# Altium project 6_Layer_Signal_Board.PrjPcb (part 1 of 2)
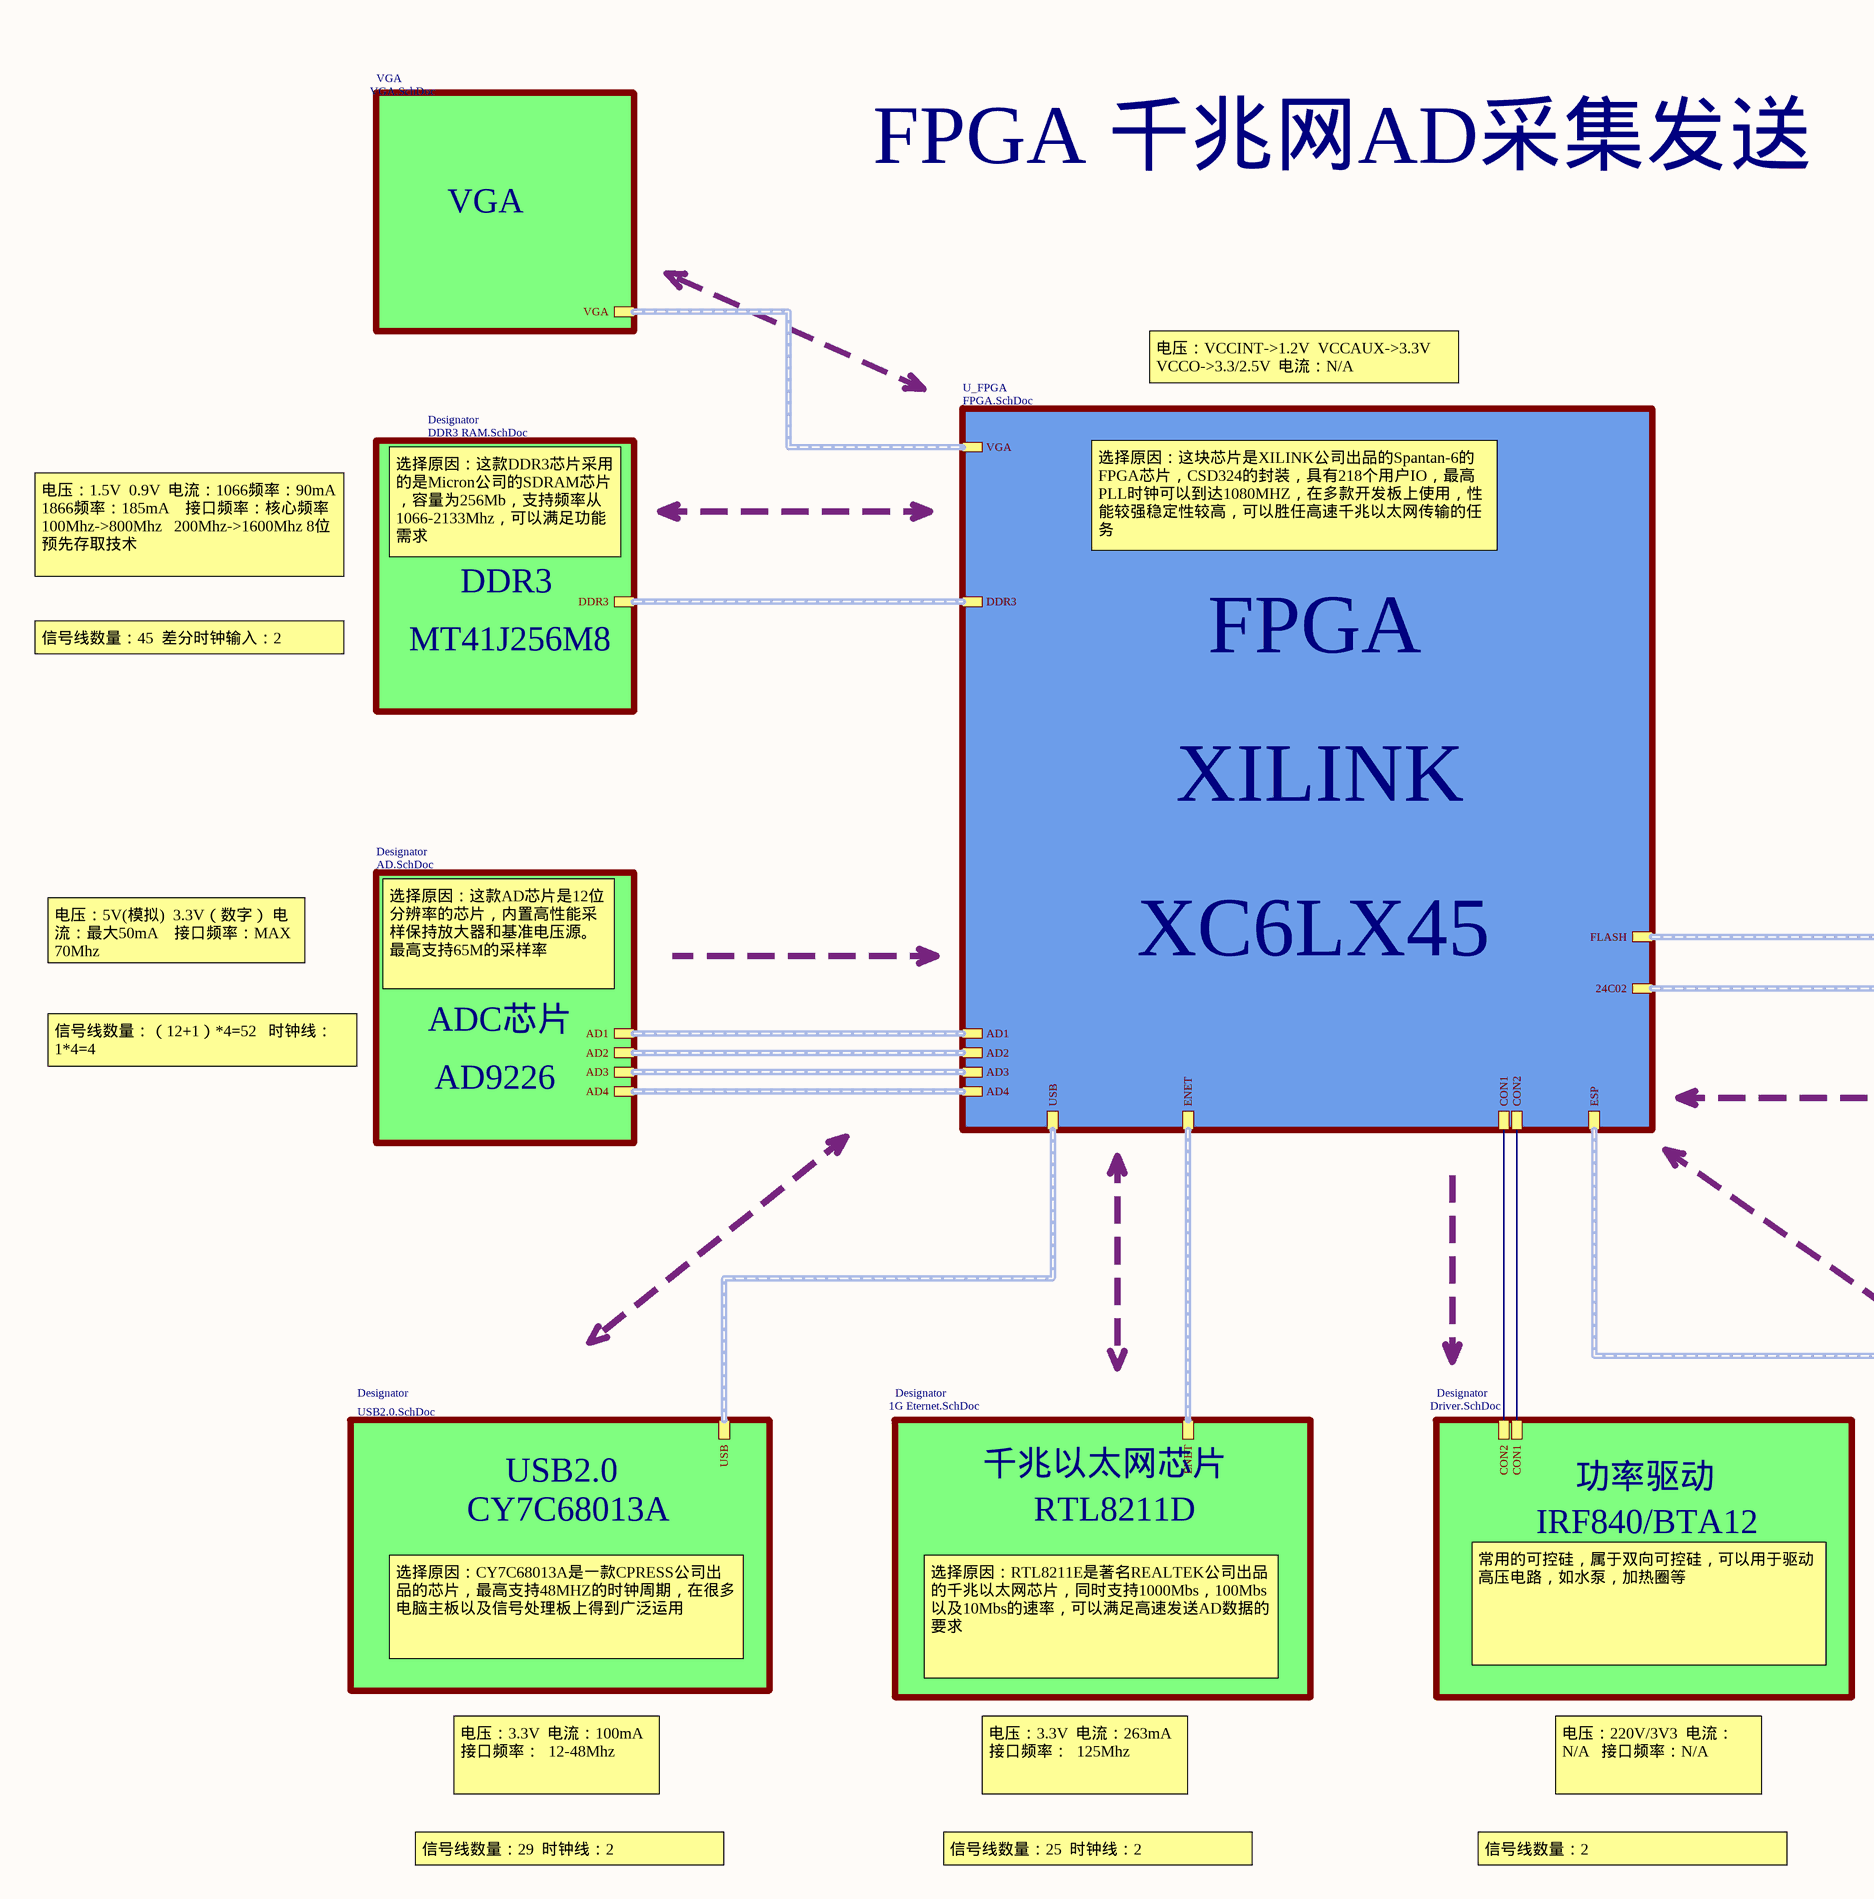
[diagram p0: TOPLEVEL.SchDoc, left]
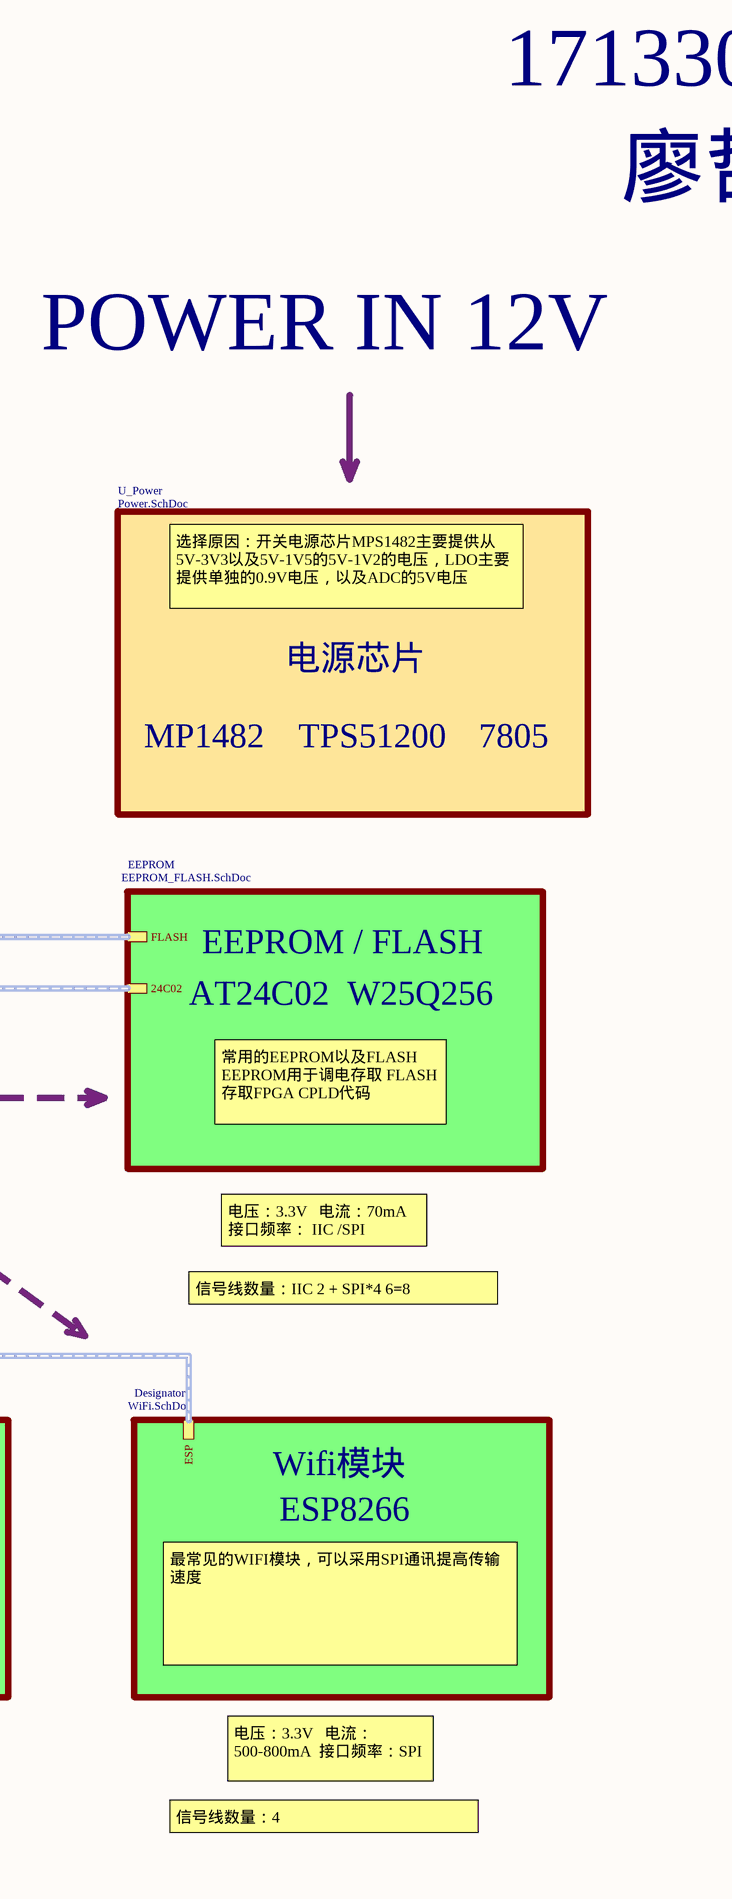
[diagram p1: TOPLEVEL.SchDoc, right]
11 sheets, 419 parts. Net scope: hierarchical (ports join the sheet entries above them; power ports are global).
Board file: 6_Layer_Singal_Board.PcbDoc
Sheets:
  TOPLEVEL.SchDoc
    U_FPGA = FPGA.SchDoc
    U_Power = Power.SchDoc
    Designator = 1G Eternet.SchDoc
    Designator = USB2.0.SchDoc
    Designator = DDR3 RAM.SchDoc
    Designator = AD.SchDoc
    Designator = Driver.SchDoc
    Designator = WiFi.SchDoc
    EEPROM = EEPROM_FLASH.SchDoc
    VGA = VGA.SchDoc

## Sheet TOPLEVEL.SchDoc
size A2; Organization: Altium Limited; Address1: L3, 12a Rodborough Rd; Address2: Frenchs Forest; Address3: NSW; Address4: Australia 2086

### Sub-sheets
Designator = 1G Eternet.SchDoc: ENET (harness ENET)
Designator = USB2.0.SchDoc: USB (harness USB)
Designator = DDR3 RAM.SchDoc: DDR3 (harness DDR3)
Designator = AD.SchDoc: AD2 (harness AD2), AD1 (harness AD1), AD4 (harness AD4), AD3 (harness AD3)
Designator = Driver.SchDoc: CON2, CON1
Designator = WiFi.SchDoc: ESP (harness ESP)
EEPROM = EEPROM_FLASH.SchDoc: 24C02 (harness 24C02), FLASH (harness FLASH)
U_FPGA = FPGA.SchDoc: DDR3 (harness DDR3), USB (harness USB), CON1, CON2, AD3 (harness AD3), AD2 (harness AD2), AD4 (harness AD4), AD1 (harness AD1), ENET (harness ENET), ESP (harness ESP), 24C02 (harness 24C02), FLASH (harness FLASH), VGA (harness VGA)
U_Power = Power.SchDoc: no entries
VGA = VGA.SchDoc: VGA (harness VGA)

### Nets
NetIC500_2: sheet U_FPGA/CON2, sheet Designator/CON1
NetIC501_2: sheet U_FPGA/CON1, sheet Designator/CON2

### Buses and harness runs
harness sheet Designator/AD1 = sheet U_FPGA/AD1
harness sheet Designator/AD2 = sheet U_FPGA/AD2
harness sheet Designator/AD3 = sheet U_FPGA/AD3
harness sheet Designator/AD4 = sheet U_FPGA/AD4
harness sheet Designator/DDR3 = sheet U_FPGA/DDR3
harness sheet Designator/ENET = sheet U_FPGA/ENET
harness sheet Designator/ESP = sheet U_FPGA/ESP
harness sheet Designator/USB = sheet U_FPGA/USB
harness sheet EEPROM/24C02 = sheet U_FPGA/24C02
harness sheet EEPROM/FLASH = sheet U_FPGA/FLASH
harness sheet U_FPGA/VGA = sheet VGA/VGA

### Notes on the sheet
- 1713304422
- FPGA 千兆网AD采集发送
- VGA
- 廖哲霖
- 电压：VCCINT->1.2V  VCCAUX->3.3V VCCO->3.3/2.5V  电流：N/A
- POWER IN 12V
- 电压：1.5V  0.9V  电流：1066频率：90mA  1866频率：185mA    接口频率：核心频率100Mhz->800Mhz   200Mhz->1600Mhz 8位预先存取技术
- 选择原因：这款DDR3芯片采用的是Micron公司的SDRAM芯片，容量为256Mb，支持频率从1066-2133Mhz，可以满足功能需求
- 选择原因：这块芯片是XILINK公司出品的Spantan-6的FPGA芯片，CSD324的封装，具有218个用户IO，最高PLL时钟可以到达1080MHZ，在多款开发板上使用，性能较强稳定性较高，可以胜任高速千兆以太网传输的任务
- DDR3
- 选择原因：开关电源芯片MPS1482主要提供从5V-3V3以及5V-1V5的5V-1V2的电压，LDO主要提供单独的0.9V电压，以及ADC的5V电压
- 信号线数量：45  差分时钟输入：2
- MT41J256M8
- FPGA
- 电源芯片
- MP1482
- TPS51200
- 7805
- XILINK
- 电压：5V(模拟)  3.3V（数字） 电流：最大50mA    接口频率：MAX 70Mhz
- EEPROM / FLASH
- 选择原因：这款AD芯片是12位分辨率的芯片，内置高性能采样保持放大器和基准电压源。最高支持65M的采样率
- XC6LX45
- AT24C02  W25Q256
- 信号线数量：（12+1）*4=52   时钟线：1*4=4
- ADC芯片
- AD9226
- 常用的EEPROM以及FLASH EEPROM用于调电存取 FLASH存取FPGA CPLD代码
- 电压：3.3V   电流：70mA 接口频率： IIC /SPI
- 信号线数量：IIC 2 + SPI*4 6=8
- 千兆以太网芯片
- Wifi模块
- CY7C68013A
- USB2.0
- RTL8211D
- IRF840/BTA12
- 功率驱动
- ESP8266
- 选择原因：CY7C68013A是一款CPRESS公司出品的芯片，最高支持48MHZ的时钟周期，在很多电脑主板以及信号处理板上得到广泛运用
- 常用的可控硅，属于双向可控硅，可以用于驱动高压电路，如水泵，加热圈等
- 最常见的WIFI模块，可以采用SPI通讯提高传输速度
- 选择原因：RTL8211E是著名REALTEK公司出品的千兆以太网芯片，同时支持1000Mbs，100Mbs以及10Mbs的速率，可以满足高速发送AD数据的要求
- 电压：3.3V  电流：100mA  接口频率：  12-48Mhz
- 电压：3.3V  电流：263mA  接口频率：  125Mhz
- 电压：220V/3V3  电流：N/A   接口频率：N/A
- 电压：3.3V   电流：500-800mA  接口频率：SPI
- 信号线数量：29  时钟线：2
- 信号线数量：25  时钟线：2
- 信号线数量：2
- 信号线数量：4
- Title
- Size:
- Date:
- File:
- A2
- Number:
- Time:
- Revision:
- Sheet
- of

## Sheet FPGA.SchDoc
size A1; Organization: Altium Limited; Address1: L3, 12a Rodborough Rd; Address2: Frenchs Forest; Address3: NSW; Address4: Australia 2086
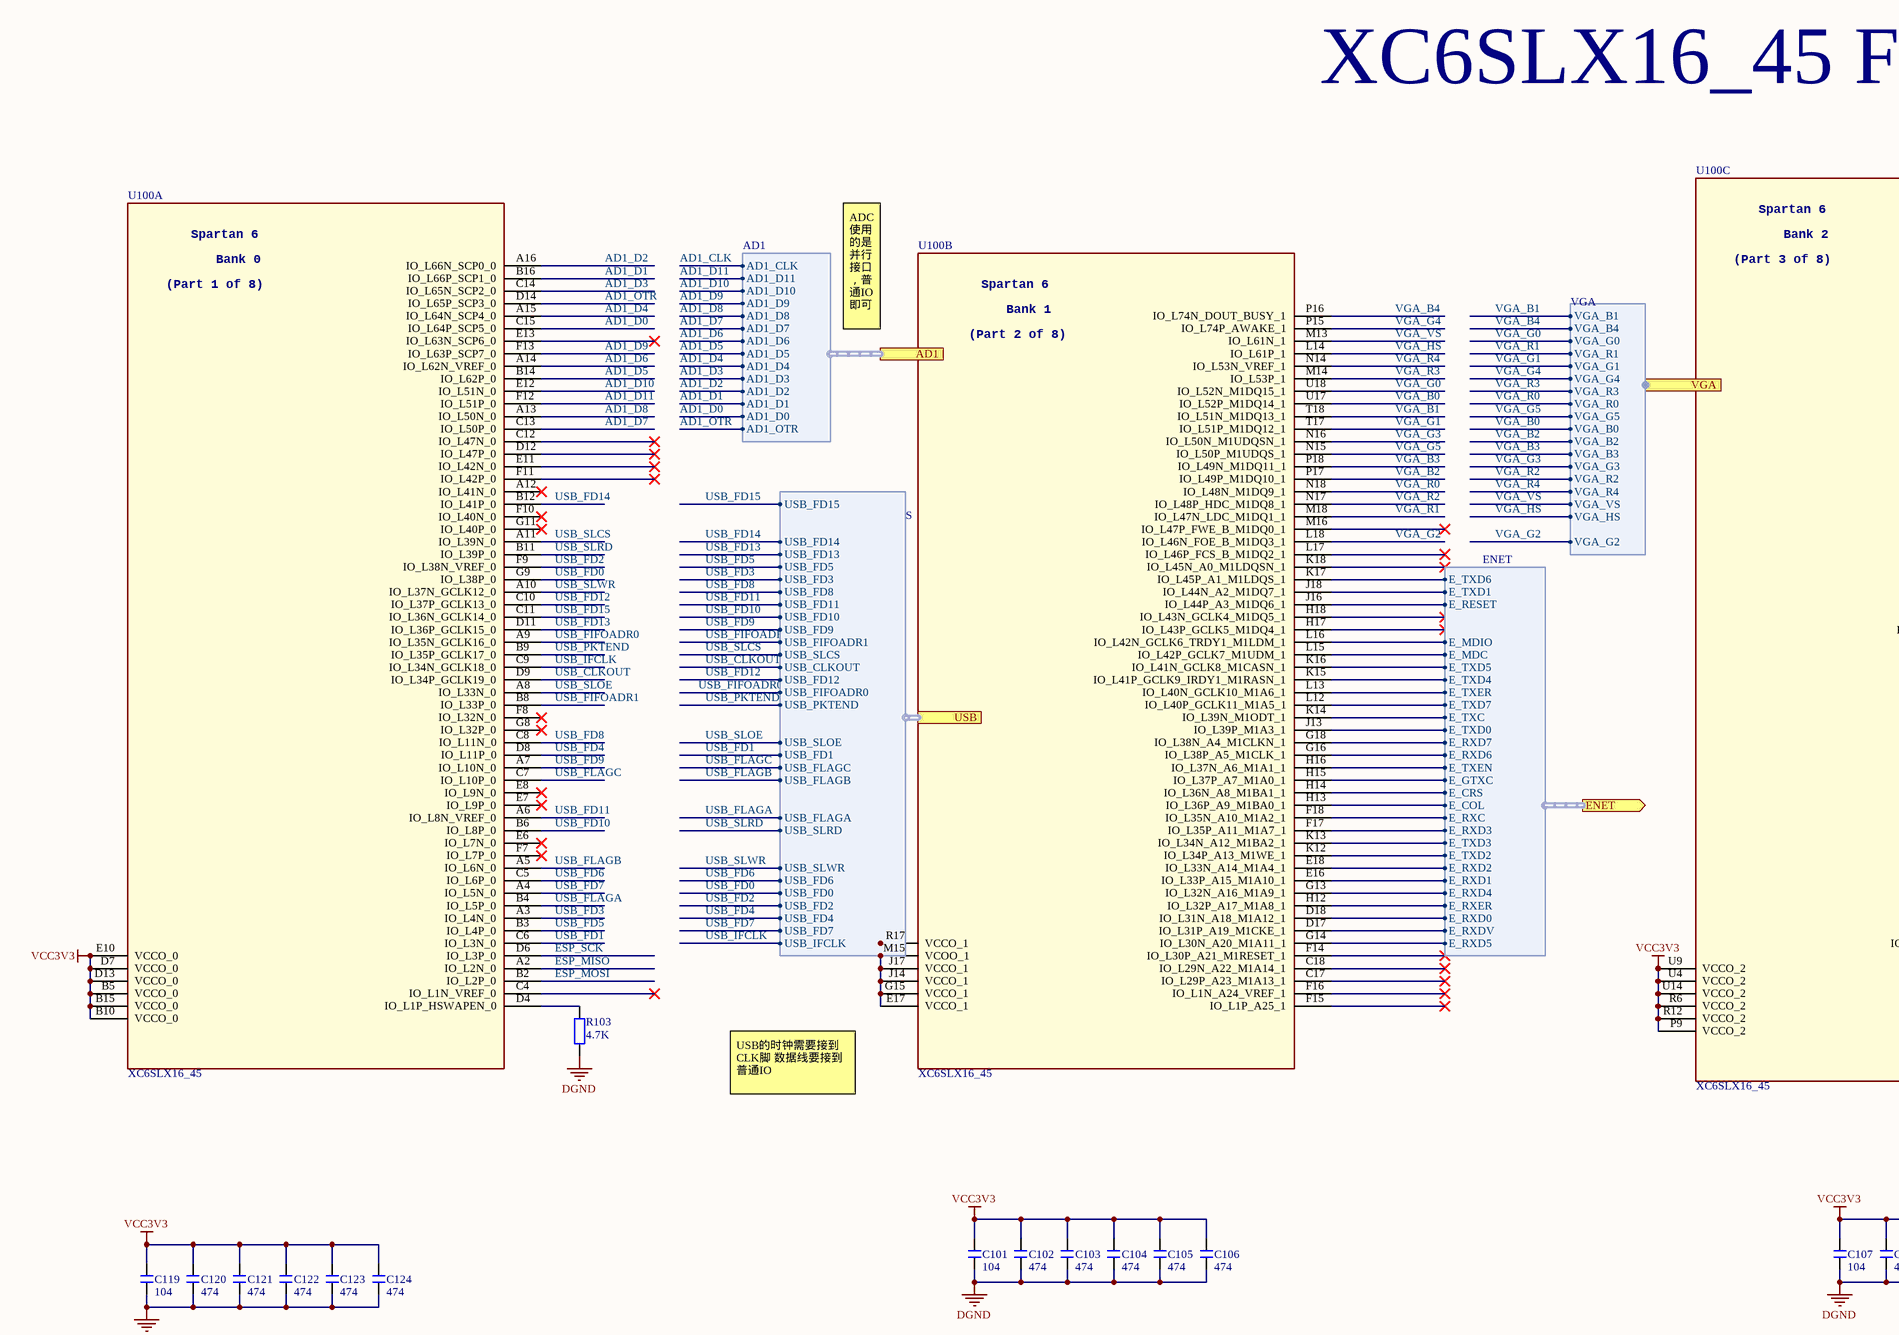
[diagram p2: FPGA.SchDoc, top left]
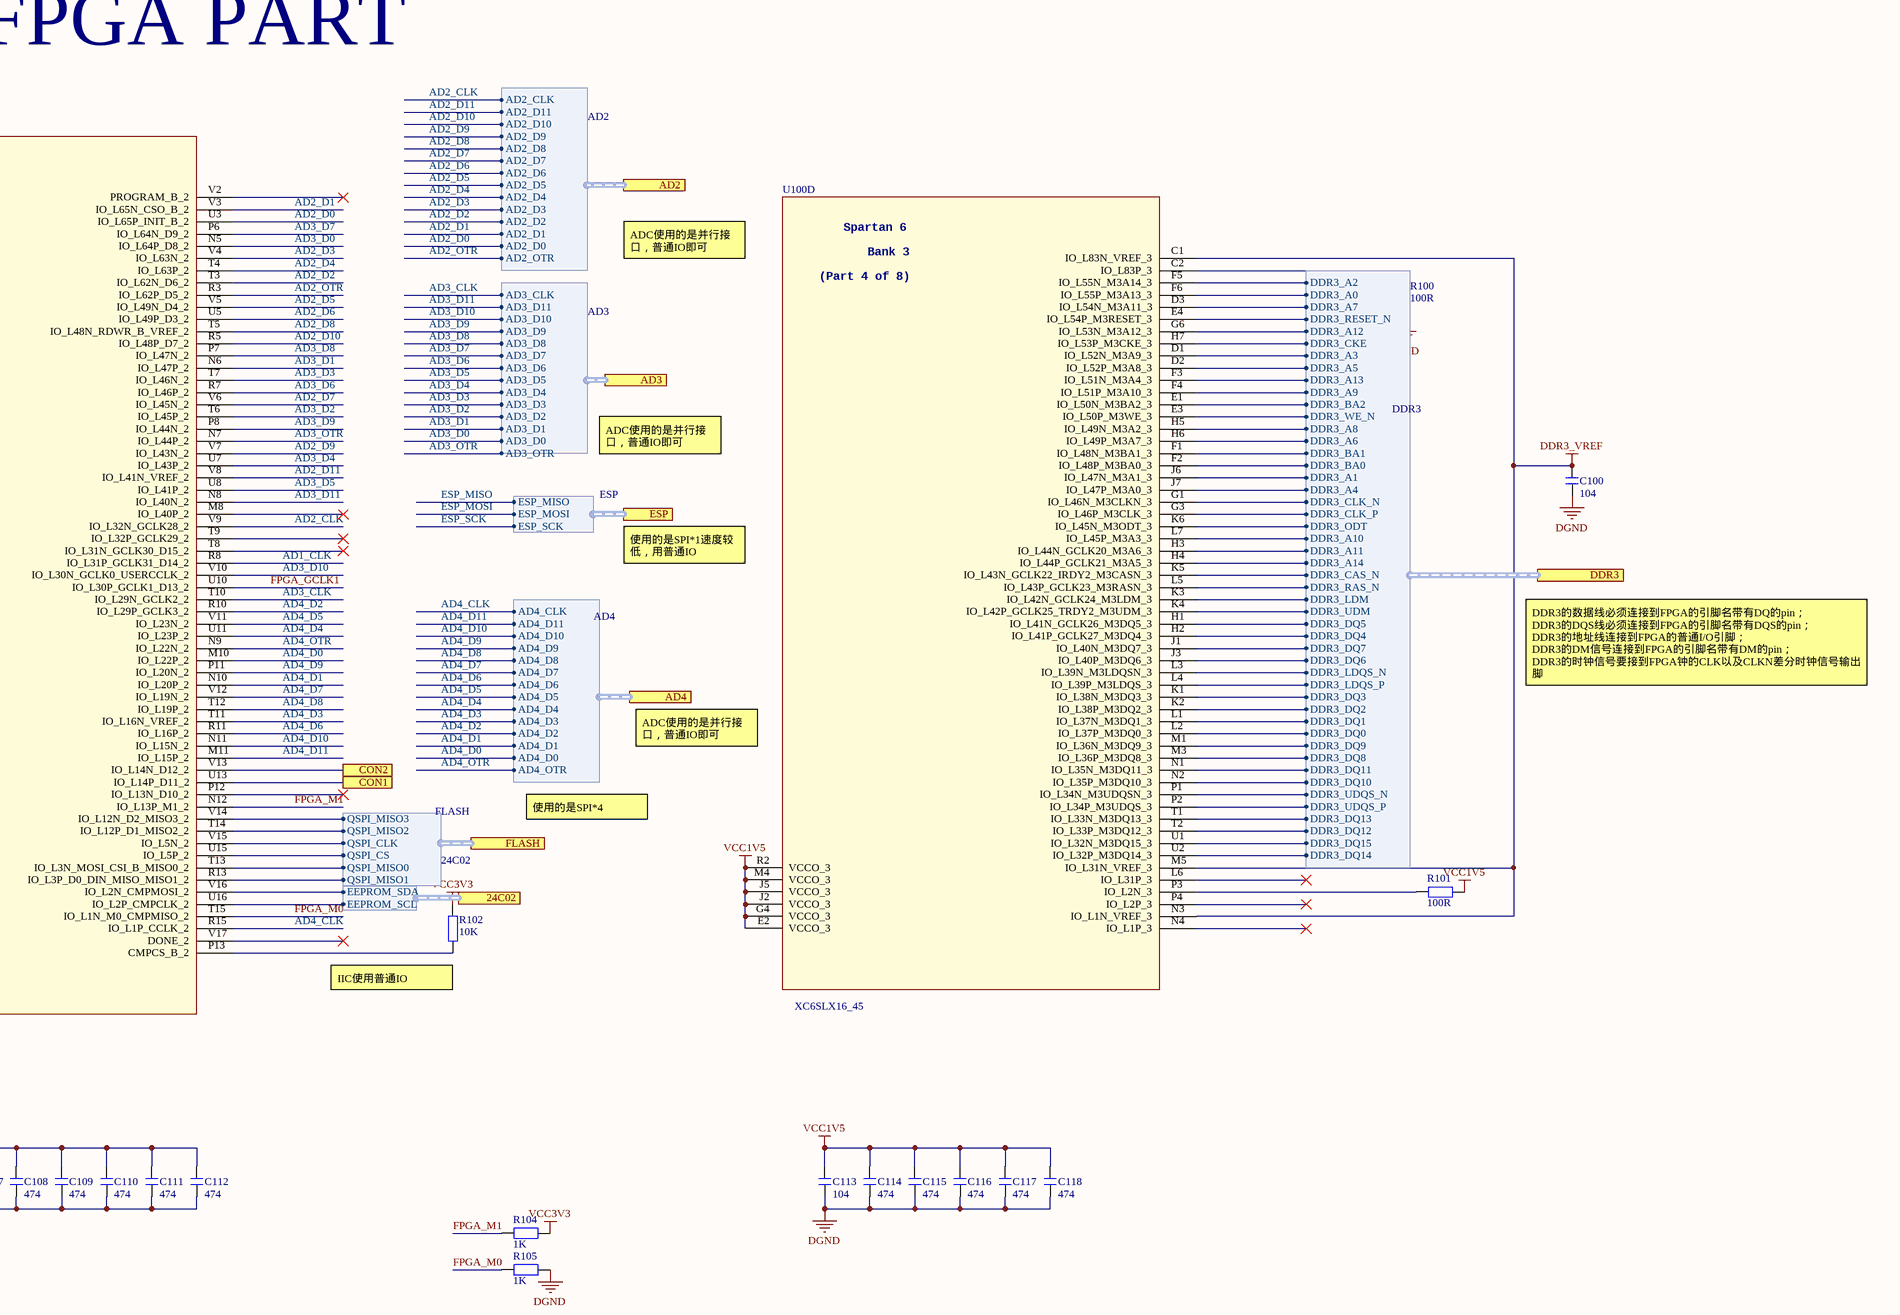
[diagram p3: FPGA.SchDoc, top right]
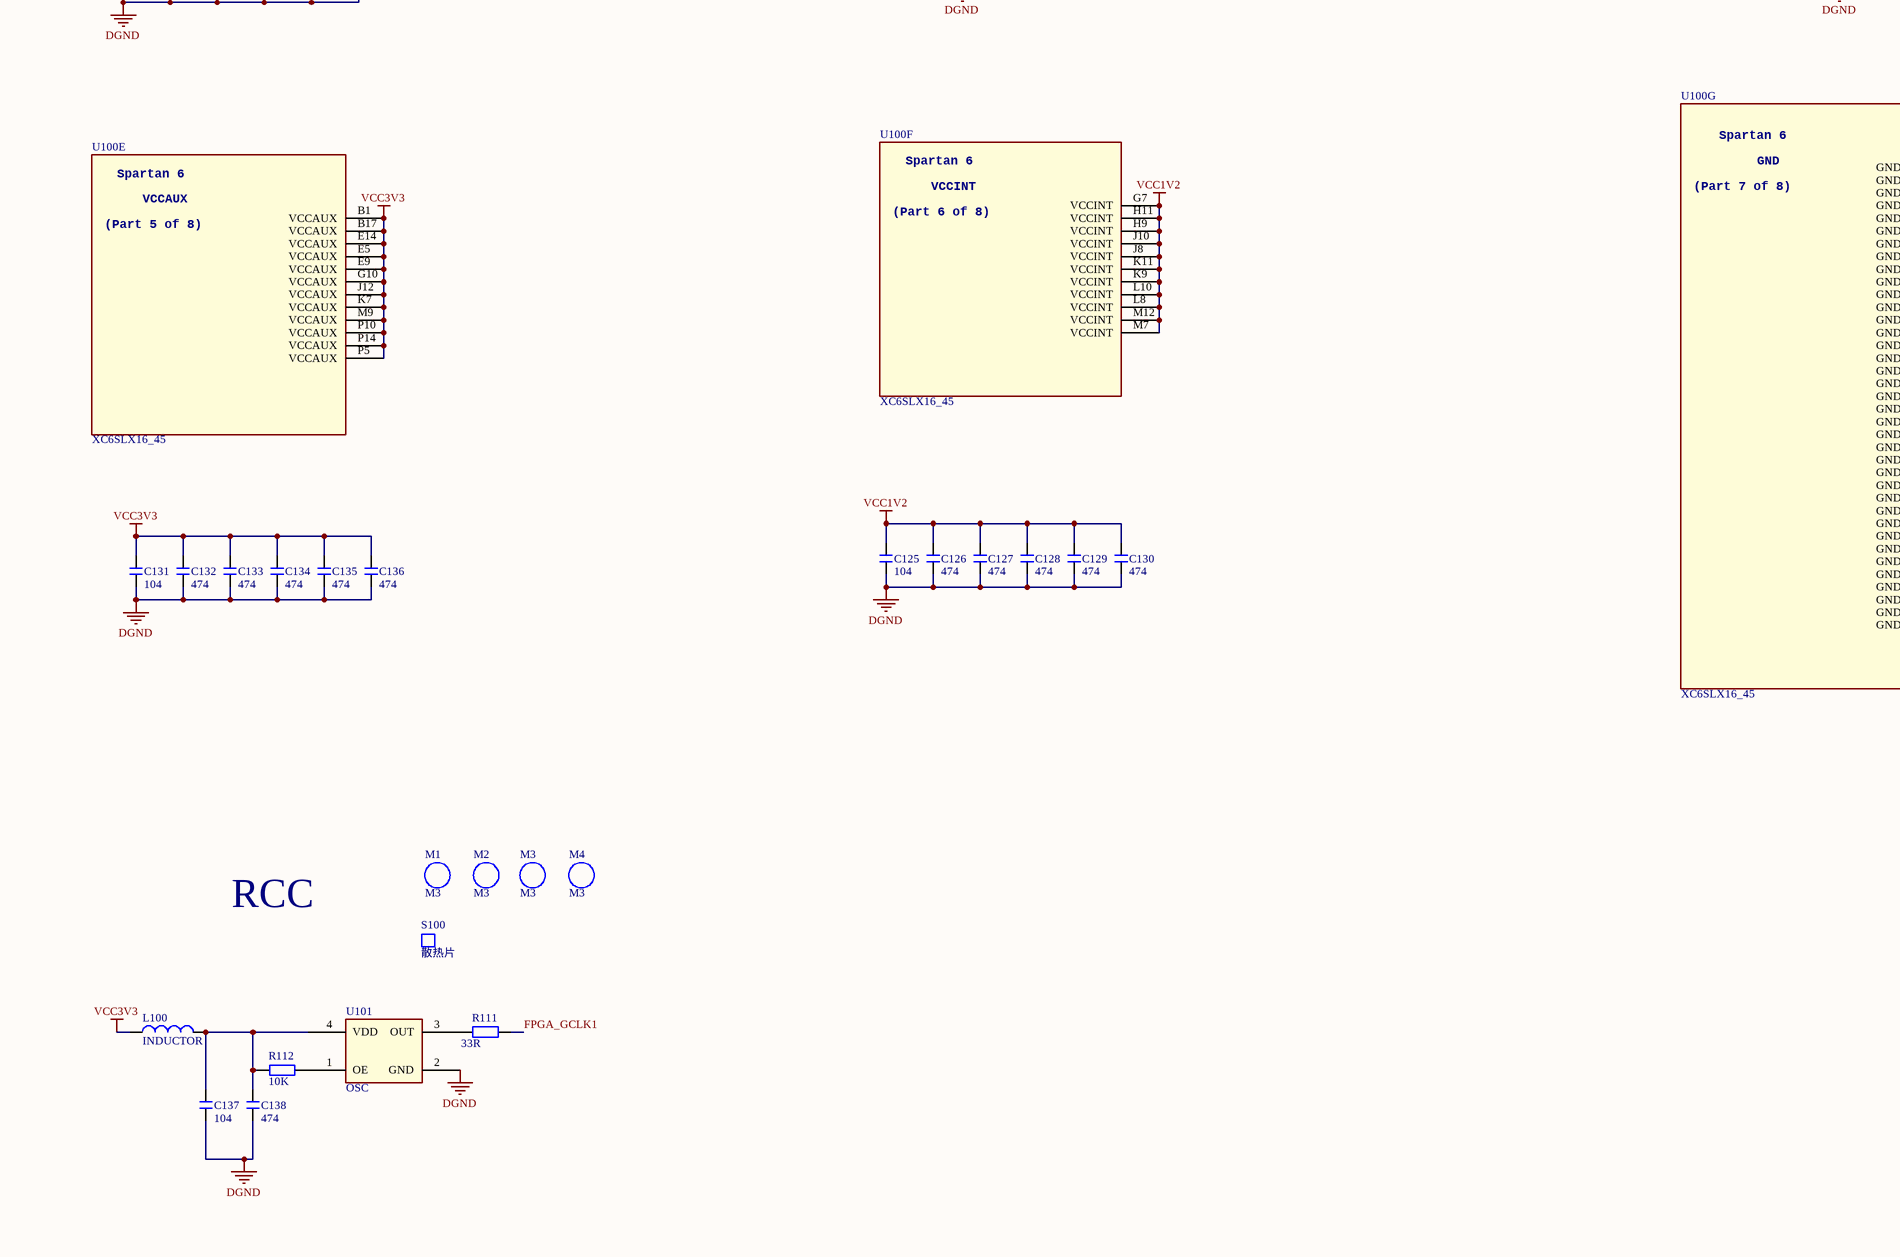
[diagram p4: FPGA.SchDoc, bottom left]
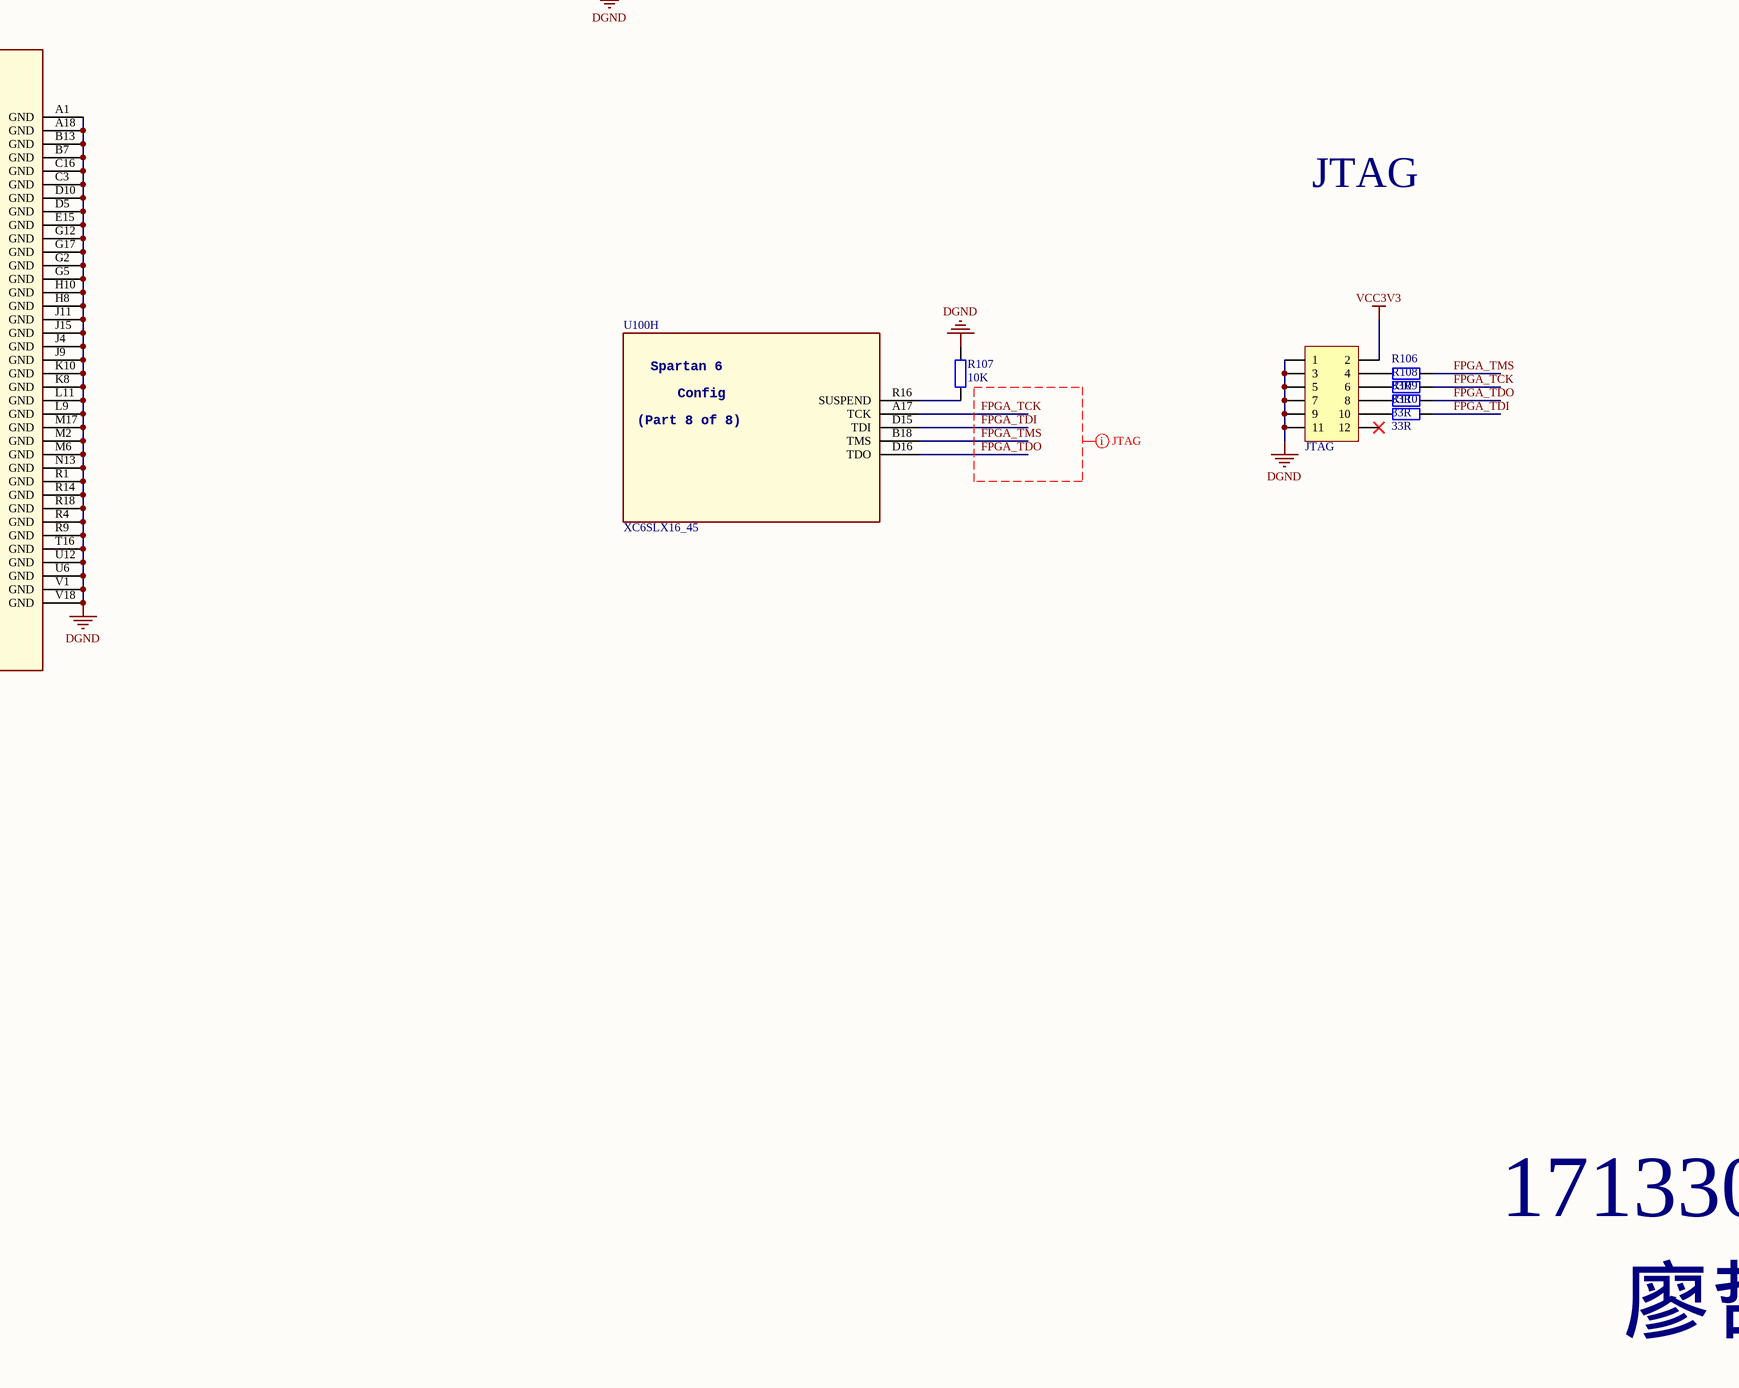
[diagram p5: FPGA.SchDoc, bottom right]

### Parts
C100  104  [C 0402_M]
C101  104  [C 0402_M]
C102  474  [C 0402_M]
C103  474  [C 0402_M]
C104  474  [C 0402_M]
C105  474  [C 0402_M]
C106  474  [C 0402_M]
C107  104  [C 0402_M]
C108  474  [C 0402_M]
C109  474  [C 0402_M]
C110  474  [C 0402_M]
C111  474  [C 0402_M]
C112  474  [C 0402_M]
C113  104  [C 0402_M]
C114  474  [C 0402_M]
C115  474  [C 0402_M]
C116  474  [C 0402_M]
C117  474  [C 0402_M]
C118  474  [C 0402_M]
C119  104  [C 0402_M]
C120  474  [C 0402_M]
C121  474  [C 0402_M]
C122  474  [C 0402_M]
C123  474  [C 0402_M]
C124  474  [C 0402_M]
C125  104  [C 0402_M]
C126  474  [C 0402_M]
C127  474  [C 0402_M]
C128  474  [C 0402_M]
C129  474  [C 0402_M]
C130  474  [C 0402_M]
C131  104  [C 0402_M]
C132  474  [C 0402_M]
C133  474  [C 0402_M]
C134  474  [C 0402_M]
C135  474  [C 0402_M]
C136  474  [C 0402_M]
C137  104  [C 0402_M]
C138  474  [C 0402_M]
JTAG  Header 6X2  [IDC2.54-LI-2x6P]  (value not drawn)
L100  INDUCTOR  [L 0805]
M1  M3  [M3 140X350]
M2  M3  [M3 140X350]
M3  M3  [M3 140X350]
M4  M3  [M3 140X350]
R100  100R  [R 0402_M]
R101  100R  [R 0402_M]
R102  10K  [R 0402_M]
R103  4.7K  [R 0402_M]
R104  1K  [R 0402_M]
R105  1K  [R 0402_M]
R106  33R  [R 0402_M]
R107  10K  [R 0402_M]
R108  33R  [R 0402_M]
R109  33R  [R 0402_M]
R110  33R  [R 0402_M]
R111  33R  [R 0402_M]
R112  10K  [R 0402_M]
S100  散热片  [SRP10-15-21]
U100  XC6SLX16_45  [BGA324C80P18X18_1500X1500X150]  (parts A,B,C,D,E,F,G,H of 8)
U101  OSC  [OSC 8045-4P]

### Ports
24C02 (harness 24C02), AD1 (harness AD1), AD2 (harness AD2), AD3 (harness AD3), AD4 (harness AD4), CON1, CON2, DDR3 (harness DDR3), ENET (out, harness ENET), ESP (harness ESP), FLASH (harness FLASH), USB (harness S), VGA (harness VGA)

### Harnesses
DDR3: DDR3_A2, DDR3_A0, DDR3_A7, DDR3_RESET_N, DDR3_A12, DDR3_CKE, DDR3_A3, DDR3_A5, DDR3_A13, DDR3_A9, DDR3_BA2, DDR3_WE_N, DDR3_A8, DDR3_A6, DDR3_BA1, DDR3_BA0, DDR3_A1, DDR3_A4, DDR3_CLK_N, DDR3_CLK_P, DDR3_ODT, DDR3_A10, DDR3_A11, DDR3_A14, DDR3_CAS_N, DDR3_RAS_N, DDR3_LDM, DDR3_UDM, DDR3_DQ5, DDR3_DQ4, DDR3_DQ7, DDR3_DQ6, DDR3_LDQS_N, DDR3_LDQS_P, DDR3_DQ3, DDR3_DQ2, DDR3_DQ1, DDR3_DQ0, DDR3_DQ9, DDR3_DQ8, DDR3_DQ11, DDR3_DQ10, DDR3_UDQS_N, DDR3_UDQS_P, DDR3_DQ13, DDR3_DQ12, DDR3_DQ15, DDR3_DQ14
ENET: E_TXD6, E_TXD1, E_RESET, E_MDIO, E_MDC, E_TXD5, E_TXD4, E_TXER, E_TXD7, E_TXC, E_TXD0, E_RXD7, E_RXD6, E_TXEN, E_GTXC, E_CRS, E_COL, E_RXC, E_RXD3, E_TXD3, E_TXD2, E_RXD2, E_RXD1, E_RXD4, E_RXER, E_RXD0, E_RXDV, E_RXD5
FLASH: QSPI_MISO3, QSPI_MISO2, QSPI_CLK, QSPI_CS, QSPI_MISO0, QSPI_MISO1
AD1: AD1_CLK, AD1_D11, AD1_D10, AD1_D9, AD1_D8, AD1_D7, AD1_D6, AD1_D5, AD1_D4, AD1_D3, AD1_D2, AD1_D1, AD1_D0, AD1_OTR
AD2: AD2_CLK, AD2_D11, AD2_D10, AD2_D9, AD2_D8, AD2_D7, AD2_D6, AD2_D5, AD2_D4, AD2_D3, AD2_D2, AD2_D1, AD2_D0, AD2_OTR
AD3: AD3_CLK, AD3_D11, AD3_D10, AD3_D9, AD3_D8, AD3_D7, AD3_D6, AD3_D5, AD3_D4, AD3_D3, AD3_D2, AD3_D1, AD3_D0, AD3_OTR
AD4: AD4_CLK, AD4_D11, AD4_D10, AD4_D9, AD4_D8, AD4_D7, AD4_D6, AD4_D5, AD4_D4, AD4_D3, AD4_D2, AD4_D1, AD4_D0, AD4_OTR
ESP: ESP_MISO, ESP_MOSI, ESP_SCK
VGA: VGA_B1, VGA_B4, VGA_G0, VGA_R1, VGA_G1, VGA_G4, VGA_R3, VGA_R0, VGA_G5, VGA_B0, VGA_G3, VGA_R2, VGA_G2, VGA_R4, VGA_VS, VGA_HS, VGA_B2, VGA_B3
S: USB_FD15, USB_FD14, USB_FD13, USB_FD5, USB_FD3, USB_FD8, USB_FD11, USB_FD10, USB_FD9, USB_FIFOADR1, USB_SLCS, USB_CLKOUT, USB_FD12, USB_FIFOADR0, USB_PKTEND, USB_SLOE, USB_FD1, USB_FLAGC, USB_FLAGB, USB_FLAGA, USB_SLRD, USB_SLWR, USB_FD6, USB_FD0, USB_FD2, USB_FD4, USB_FD7, USB_IFCLK
24C02: EEPROM_SDA, EEPROM_SCL

### Nets
DDR3_VREF: C100.2 U100.C1(IO_L83N_VREF_3) U100.M5(IO_L31N_VREF_3) U100.N3(IO_L1N_VREF_3)
DGND: C100.1 C101.1 C102.1 C103.1 C104.1 C105.1 C106.1 C107.1 C108.1 C109.1 C110.1 C111.1 C112.1 C113.1 C114.1 C115.1 C116.1 C117.1 C118.1 C119.1 C120.1 C121.1 C122.1 C123.1 C124.1 C125.1 C126.1 C127.1 C128.1 C129.1 C130.1 C131.1 C132.1 C133.1 C134.1 C135.1 C136.1 C137.1 C138.1 JTAG.1 JTAG.3 JTAG.5 JTAG.7 JTAG.9 JTAG.11 R100.1 R103.1 R105.2 R107.1 U100.A1(GND) U100.A18(GND) U100.B7(GND) U100.B13(GND) U100.C3(GND) U100.C16(GND) U100.D5(GND) U100.D10(GND) U100.E15(GND) U100.G2(GND) U100.G5(GND) U100.G12(GND) U100.G17(GND) U100.H8(GND) U100.H10(GND) U100.J4(GND) U100.J9(GND) U100.J11(GND) U100.J15(GND) U100.K8(GND) U100.K10(GND) U100.L9(GND) U100.L11(GND) U100.M2(GND) U100.M6(GND) U100.M17(GND) U100.N13(GND) U100.R1(GND) U100.R4(GND) U100.R9(GND) U100.R14(GND) U100.R18(GND) U100.T16(GND) U100.U6(GND) U100.U12(GND) U100.V1(GND) U100.V18(GND) U101.2(GND)
VCC1V2: C125.2 C126.2 C127.2 C128.2 C129.2 C130.2 U100.G7(VCCINT) U100.H9(VCCINT) U100.H11(VCCINT) U100.J8(VCCINT) U100.J10(VCCINT) U100.K9(VCCINT) U100.K11(VCCINT) U100.L8(VCCINT) U100.L10(VCCINT) U100.M7(VCCINT) U100.M12(VCCINT)
VCC1V5: C113.2 C114.2 C115.2 C116.2 C117.2 C118.2 R101.1 U100.E2(VCCO_3) U100.G4(VCCO_3) U100.J2(VCCO_3) U100.J5(VCCO_3) U100.M4(VCCO_3) U100.R2(VCCO_3)
VCC3V3: C101.2 C102.2 C103.2 C104.2 C105.2 C106.2 C107.2 C108.2 C109.2 C110.2 C111.2 C112.2 C119.2 C120.2 C121.2 C122.2 C123.2 C124.2 C131.2 C132.2 C133.2 C134.2 C135.2 C136.2 JTAG.2 L100.1 R102.1 R104.2 U100.B1(VCCAUX) U100.B5(VCCO_0) U100.B10(VCCO_0) U100.B15(VCCO_0) U100.B17(VCCAUX) U100.D7(VCCO_0) U100.D13(VCCO_0) U100.E5(VCCAUX) U100.E9(VCCAUX) U100.E10(VCCO_0) U100.E14(VCCAUX) U100.E17(VCCO_1) U100.G10(VCCAUX) U100.G15(VCCO_1) U100.J12(VCCAUX) U100.J14(VCCO_1) U100.J17(VCCO_1) U100.K7(VCCAUX) U100.M9(VCCAUX) U100.M15(VCOO_1) U100.P5(VCCAUX) U100.P9(VCCO_2) U100.P10(VCCAUX) U100.P14(VCCAUX) U100.R6(VCCO_2) U100.R12(VCCO_2) U100.R17(VCCO_1) U100.U4(VCCO_2) U100.U9(VCCO_2) U100.U14(VCCO_2)
A0: U100.F6(IO_L55P_M3A13_3) ; port DDR3.DDR3_A0
A1: U100.J6(IO_L47N_M3A1_3) ; port DDR3.DDR3_A1
A2: U100.F5(IO_L55N_M3A14_3) ; port DDR3.DDR3_A2
A3: U100.D1(IO_L52N_M3A9_3) ; port DDR3.DDR3_A3
A4: U100.J7(IO_L47P_M3A0_3) ; port DDR3.DDR3_A4
A5: U100.D2(IO_L52P_M3A8_3) ; port DDR3.DDR3_A5
A6: U100.H6(IO_L49P_M3A7_3) ; port DDR3.DDR3_A6
A7: U100.D3(IO_L54N_M3A11_3) ; port DDR3.DDR3_A7
A8: U100.H5(IO_L49N_M3A2_3) ; port DDR3.DDR3_A8
A9: U100.F4(IO_L51P_M3A10_3) ; port DDR3.DDR3_A9
A10: U100.L7(IO_L45P_M3A3_3) ; port DDR3.DDR3_A10
A11: U100.H3(IO_L44N_GCLK20_M3A6_3) ; port DDR3.DDR3_A11
A12: U100.G6(IO_L53N_M3A12_3) ; port DDR3.DDR3_A12
A13: U100.F3(IO_L51N_M3A4_3) ; port DDR3.DDR3_A13
A14: U100.H4(IO_L44P_GCLK21_M3A5_3) ; port DDR3.DDR3_A14
AD1_CLK: U100.R8(IO_L31P_GCLK31_D14_2) ; port AD1.AD1_CLK
AD1_D0: U100.C15(IO_L64P_SCP5_0) ; port AD1.AD1_D0
AD1_D1: U100.B16(IO_L66P_SCP1_0) ; port AD1.AD1_D1
AD1_D2: U100.A16(IO_L66N_SCP0_0) ; port AD1.AD1_D2
AD1_D3: U100.C14(IO_L65N_SCP2_0) ; port AD1.AD1_D3
AD1_D4: U100.A15(IO_L64N_SCP4_0) ; port AD1.AD1_D4
AD1_D5: U100.B14(IO_L62P_0) ; port AD1.AD1_D5
AD1_D6: U100.A14(IO_L62N_VREF_0) ; port AD1.AD1_D6
AD1_D7: U100.C13(IO_L50P_0) ; port AD1.AD1_D7
AD1_D8: U100.A13(IO_L50N_0) ; port AD1.AD1_D8
AD1_D9: U100.F13(IO_L63P_SCP7_0) ; port AD1.AD1_D9
AD1_D10: U100.E12(IO_L51N_0) ; port AD1.AD1_D10
AD1_D11: U100.F12(IO_L51P_0) ; port AD1.AD1_D11
AD1_OTR: U100.D14(IO_L65P_SCP3_0) ; port AD1.AD1_OTR  [project net AD1_ODR]
AD2_CLK: U100.V9(IO_L32N_GCLK28_2) ; port AD2.AD2_CLK
AD2_D0: U100.U3(IO_L65P_INIT_B_2) ; port AD2.AD2_D0
AD2_D1: U100.V3(IO_L65N_CSO_B_2) ; port AD2.AD2_D1
AD2_D2: U100.T3(IO_L62N_D6_2) ; port AD2.AD2_D2
AD2_D3: U100.V4(IO_L63N_2) ; port AD2.AD2_D3
AD2_D4: U100.T4(IO_L63P_2) ; port AD2.AD2_D4
AD2_D5: U100.V5(IO_L49N_D4_2) ; port AD2.AD2_D5
AD2_D6: U100.U5(IO_L49P_D3_2) ; port AD2.AD2_D6
AD2_D7: U100.V6(IO_L45N_2) ; port AD2.AD2_D7
AD2_D8: U100.T5(IO_L48N_RDWR_B_VREF_2) ; port AD2.AD2_D8
AD2_D9: U100.V7(IO_L43N_2) ; port AD2.AD2_D9
AD2_D10: U100.R5(IO_L48P_D7_2) ; port AD2.AD2_D10
AD2_D11: U100.V8(IO_L41N_VREF_2) ; port AD2.AD2_D11
AD2_OTR: U100.R3(IO_L62P_D5_2) ; port AD2.AD2_OTR  [project net AD2_ODR]
AD3_CLK: U100.T10(IO_L29N_GCLK2_2) ; port AD3.AD3_CLK
AD3_D0: U100.N5(IO_L64P_D8_2) ; port AD3.AD3_D0
AD3_D1: U100.N6(IO_L47P_2) ; port AD3.AD3_D1
AD3_D2: U100.T6(IO_L45P_2) ; port AD3.AD3_D2
AD3_D3: U100.T7(IO_L46N_2) ; port AD3.AD3_D3
AD3_D4: U100.U7(IO_L43P_2) ; port AD3.AD3_D4
AD3_D5: U100.U8(IO_L41P_2) ; port AD3.AD3_D5
AD3_D6: U100.R7(IO_L46P_2) ; port AD3.AD3_D6
AD3_D7: U100.P6(IO_L64N_D9_2) ; port AD3.AD3_D7
AD3_D8: U100.P7(IO_L47N_2) ; port AD3.AD3_D8
AD3_D9: U100.P8(IO_L44N_2) ; port AD3.AD3_D9
AD3_D10: U100.V10(IO_L30N_GCLK0_USERCCLK_2) ; port AD3.AD3_D10
AD3_D11: U100.N8(IO_L40N_2) ; port AD3.AD3_D11
AD3_OTR: U100.N7(IO_L44P_2) ; port AD3.AD3_OTR  [project net AD3_ODR]
AD4_CLK: U100.R15(IO_L1P_CCLK_2) ; port AD4.AD4_CLK
AD4_D0: U100.M10(IO_L22P_2) ; port AD4.AD4_D0
AD4_D1: U100.N10(IO_L20P_2) ; port AD4.AD4_D1
AD4_D2: U100.R10(IO_L29P_GCLK3_2) ; port AD4.AD4_D2
AD4_D3: U100.T11(IO_L16N_VREF_2) ; port AD4.AD4_D3
AD4_D4: U100.U11(IO_L23P_2) ; port AD4.AD4_D4
AD4_D5: U100.V11(IO_L23N_2) ; port AD4.AD4_D5
AD4_D6: U100.R11(IO_L16P_2) ; port AD4.AD4_D6
AD4_D7: U100.V12(IO_L19N_2) ; port AD4.AD4_D7
AD4_D8: U100.T12(IO_L19P_2) ; port AD4.AD4_D8
AD4_D9: U100.P11(IO_L20N_2) ; port AD4.AD4_D9
AD4_D10: U100.N11(IO_L15N_2) ; port AD4.AD4_D10
AD4_D11: U100.M11(IO_L15P_2) ; port AD4.AD4_D11
AD4_OTR: U100.N9(IO_L22N_2) ; port AD4.AD4_OTR  [project net AD4_ODR]
BA0: U100.F2(IO_L48P_M3BA0_3) ; port DDR3.DDR3_BA0
BA1: U100.F1(IO_L48N_M3BA1_3) ; port DDR3.DDR3_BA1
BA2: U100.E1(IO_L50N_M3BA2_3) ; port DDR3.DDR3_BA2
CAS_N: U100.K5(IO_L43N_GCLK22_IRDY2_M3CASN_3) ; port DDR3.DDR3_CAS_N
CKE: U100.H7(IO_L53P_M3CKE_3) ; port DDR3.DDR3_CKE
CLK: U100.V15(IO_L5N_2) ; port FLASH.QSPI_CLK
CLK_N: U100.G1(IO_L46N_M3CLKN_3) ; port DDR3.DDR3_CLK_N
CLK_P: U100.G3(IO_L46P_M3CLK_3) ; port DDR3.DDR3_CLK_P
COL: U100.H13(IO_L36P_A9_M1BA0_1) ; port ENET.E_COL
CRS: U100.H14(IO_L36N_A8_M1BA1_1) ; port ENET.E_CRS
CS: U100.U15(IO_L5P_2) ; port FLASH.QSPI_CS
DQ0: U100.L2(IO_L37P_M3DQ0_3) ; port DDR3.DDR3_DQ0
DQ1: U100.L1(IO_L37N_M3DQ1_3) ; port DDR3.DDR3_DQ1
DQ2: U100.K2(IO_L38P_M3DQ2_3) ; port DDR3.DDR3_DQ2
DQ3: U100.K1(IO_L38N_M3DQ3_3) ; port DDR3.DDR3_DQ3
DQ4: U100.H2(IO_L41P_GCLK27_M3DQ4_3) ; port DDR3.DDR3_DQ4
DQ5: U100.H1(IO_L41N_GCLK26_M3DQ5_3) ; port DDR3.DDR3_DQ5
DQ6: U100.J3(IO_L40P_M3DQ6_3) ; port DDR3.DDR3_DQ6
DQ7: U100.J1(IO_L40N_M3DQ7_3) ; port DDR3.DDR3_DQ7
DQ8: U100.M3(IO_L36P_M3DQ8_3) ; port DDR3.DDR3_DQ8
DQ9: U100.M1(IO_L36N_M3DQ9_3) ; port DDR3.DDR3_DQ9
DQ10: U100.N2(IO_L35P_M3DQ10_3) ; port DDR3.DDR3_DQ10
DQ11: U100.N1(IO_L35N_M3DQ11_3) ; port DDR3.DDR3_DQ11
DQ12: U100.T2(IO_L33P_M3DQ12_3) ; port DDR3.DDR3_DQ12
DQ13: U100.T1(IO_L33N_M3DQ13_3) ; port DDR3.DDR3_DQ13
DQ14: U100.U2(IO_L32P_M3DQ14_3) ; port DDR3.DDR3_DQ14
DQ15: U100.U1(IO_L32N_M3DQ15_3) ; port DDR3.DDR3_DQ15
ESP_MISO: U100.A2(IO_L2N_0) ; port ESP.ESP_MISO
ESP_MOSI: U100.B2(IO_L2P_0) ; port ESP.ESP_MOSI
ESP_SCK: U100.D6(IO_L3P_0) ; port ESP.ESP_SCK
FPGA_GCLK1: R111.2 U100.U10(IO_L30P_GCLK1_D13_2)
FPGA_M0: R105.1 U100.T15(IO_L1N_M0_CMPMISO_2)
FPGA_M1: R104.1 U100.N12(IO_L13P_M1_2)
FPGA_TCK: R108.2 U100.A17(TCK)
FPGA_TDI: R110.2 U100.D15(TDI)
FPGA_TDO: R109.2 U100.D16(TDO)
FPGA_TMS: R106.2 U100.B18(TMS)
GTXC: U100.H15(IO_L37P_A7_M1A0_1) ; port ENET.E_GTXC
LDM: U100.K3(IO_L42N_GCLK24_M3LDM_3) ; port DDR3.DDR3_LDM
LDQS_N: U100.L3(IO_L39N_M3LDQSN_3) ; port DDR3.DDR3_LDQS_N
LDQS_P: U100.L4(IO_L39P_M3LDQS_3) ; port DDR3.DDR3_LDQS_P
MDC: U100.L15(IO_L42P_GCLK7_M1UDM_1) ; port ENET.E_MDC
MDIO: U100.L16(IO_L42N_GCLK6_TRDY1_M1LDM_1) ; port ENET.E_MDIO
MISO0: U100.T13(IO_L3N_MOSI_CSI_B_MISO0_2) ; port FLASH.QSPI_MISO0
MISO1: U100.R13(IO_L3P_D0_DIN_MISO_MISO1_2) ; port FLASH.QSPI_MISO1
MISO2: U100.T14(IO_L12P_D1_MISO2_2) ; port FLASH.QSPI_MISO2
MISO3: U100.V14(IO_L12N_D2_MISO3_2) ; port FLASH.QSPI_MISO3
ODT: U100.K6(IO_L45N_M3ODT_3) ; port DDR3.DDR3_ODT
RAS_N: U100.L5(IO_L43P_GCLK23_M3RASN_3) ; port DDR3.DDR3_RAS_N
RESET: U100.J16(IO_L44P_A3_M1DQ6_1) ; port ENET.E_RESET
RESET_N: U100.E4(IO_L54P_M3RESET_3) ; port DDR3.DDR3_RESET_N
RXC: U100.F18(IO_L35N_A10_M1A2_1) ; port ENET.E_RXC
RXD0: U100.D18(IO_L31N_A18_M1A12_1) ; port ENET.E_RXD0
RXD1: U100.E16(IO_L33P_A15_M1A10_1) ; port ENET.E_RXD1
RXD2: U100.E18(IO_L33N_A14_M1A4_1) ; port ENET.E_RXD2
RXD3: U100.F17(IO_L35P_A11_M1A7_1) ; port ENET.E_RXD3
RXD4: U100.G13(IO_L32N_A16_M1A9_1) ; port ENET.E_RXD4
RXD5: U100.G14(IO_L30N_A20_M1A11_1) ; port ENET.E_RXD5
RXD6: U100.G16(IO_L38P_A5_M1CLK_1) ; port ENET.E_RXD6
RXD7: U100.G18(IO_L38N_A4_M1CLKN_1) ; port ENET.E_RXD7
RXDV: U100.D17(IO_L31P_A19_M1CKE_1) ; port ENET.E_RXDV
RXER: U100.H12(IO_L32P_A17_M1A8_1) ; port ENET.E_RXER
TXC: U100.K14(IO_L39N_M1ODT_1) ; port ENET.E_TXC
TXD0: U100.J13(IO_L39P_M1A3_1) ; port ENET.E_TXD0
TXD1: U100.J18(IO_L44N_A2_M1DQ7_1) ; port ENET.E_TXD1
TXD2: U100.K12(IO_L34P_A13_M1WE_1) ; port ENET.E_TXD2
TXD3: U100.K13(IO_L34N_A12_M1BA2_1) ; port ENET.E_TXD3
TXD4: U100.K15(IO_L41P_GCLK9_IRDY1_M1RASN_1) ; port ENET.E_TXD4
TXD5: U100.K16(IO_L41N_GCLK8_M1CASN_1) ; port ENET.E_TXD5
TXD6: U100.K17(IO_L45P_A1_M1LDQS_1) ; port ENET.E_TXD6
TXD7: U100.L12(IO_L40P_GCLK11_M1A5_1) ; port ENET.E_TXD7
TXEN: U100.H16(IO_L37N_A6_M1A1_1) ; port ENET.E_TXEN
TXER: U100.L13(IO_L40N_GCLK10_M1A6_1) ; port ENET.E_TXER
UDM: U100.K4(IO_L42P_GCLK25_TRDY2_M3UDM_3) ; port DDR3.DDR3_UDM
UDQS_N: U100.P1(IO_L34N_M3UDQSN_3) ; port DDR3.DDR3_UDQS_N
UDQS_P: U100.P2(IO_L34P_M3UDQS_3) ; port DDR3.DDR3_UDQS_P
USB_CLKOUT: U100.D9(IO_L34P_GCLK19_0) ; port USB.USB_CLKOUT  [project net USB_CLK_P]
USB_FD0: U100.G9(IO_L38P_0) ; port USB.USB_FD0
USB_FD1: U100.C6(IO_L3N_0) ; port USB.USB_FD1
USB_FD2: U100.F9(IO_L38N_VREF_0) ; port USB.USB_FD2
USB_FD3: U100.A3(IO_L4N_0) ; port USB.USB_FD3
USB_FD4: U100.D8(IO_L11P_0) ; port USB.USB_FD4
USB_FD5: U100.B3(IO_L4P_0) ; port USB.USB_FD5
USB_FD6: U100.C5(IO_L6P_0) ; port USB.USB_FD6
USB_FD7: U100.A4(IO_L5N_0) ; port USB.USB_FD7
USB_FD8: U100.C8(IO_L11N_0) ; port USB.USB_FD8
USB_FD9: U100.A7(IO_L10N_0) ; port USB.USB_FD9
USB_FD10: U100.B6(IO_L8P_0) ; port USB.USB_FD10
USB_FD11: U100.A6(IO_L8N_VREF_0) ; port USB.USB_FD11
USB_FD12: U100.C10(IO_L37P_GCLK13_0) ; port USB.USB_FD12
USB_FD13: U100.D11(IO_L36P_GCLK15_0) ; port USB.USB_FD13
USB_FD14: U100.B12(IO_L41P_0) ; port USB.USB_FD14
USB_FD15: U100.C11(IO_L36N_GCLK14_0) ; port USB.USB_FD15
USB_FIFOADR0: U100.A9(IO_L35N_GCLK16_0) ; port USB.USB_FIFOADR0
USB_FIFOADR1: U100.B8(IO_L33P_0) ; port USB.USB_FIFOADR1
USB_FLAGA: U100.B4(IO_L5P_0) ; port USB.USB_FLAGA
USB_FLAGB: U100.A5(IO_L6N_0) ; port USB.USB_FLAGB
USB_FLAGC: U100.C7(IO_L10P_0) ; port USB.USB_FLAGC
USB_IFCLK: U100.C9(IO_L34N_GCLK18_0) ; port USB.USB_IFCLK  [project net USB_CLK_N]
USB_PKTEND: U100.B9(IO_L35P_GCLK17_0) ; port USB.USB_PKTEND
USB_SLCS: U100.A11(IO_L39N_0) ; port USB.USB_SLCS
USB_SLOE: U100.A8(IO_L33N_0) ; port USB.USB_SLOE
USB_SLRD: U100.B11(IO_L39P_0) ; port USB.USB_SLRD
USB_SLWR: U100.A10(IO_L37N_GCLK12_0) ; port USB.USB_SLWR
VGA_B0: U100.U17(IO_L52P_M1DQ14_1) ; port VGA.VGA_B0  [project net B0]
VGA_B1: U100.T18(IO_L51N_M1DQ13_1) ; port VGA.VGA_B1  [project net B1]
VGA_B2: U100.P17(IO_L49P_M1DQ10_1) ; port VGA.VGA_B2  [project net B2]
VGA_B3: U100.P18(IO_L49N_M1DQ11_1) ; port VGA.VGA_B3  [project net B3]
VGA_B4: U100.P16(IO_L74N_DOUT_BUSY_1) ; port VGA.VGA_B4  [project net B4]
VGA_G0: U100.U18(IO_L52N_M1DQ15_1) ; port VGA.VGA_G0  [project net G0]
VGA_G1: U100.T17(IO_L51P_M1DQ12_1) ; port VGA.VGA_G1  [project net G1]
VGA_G2: U100.L18(IO_L46N_FOE_B_M1DQ3_1) ; port VGA.VGA_G2  [project net G2]
VGA_G3: U100.N16(IO_L50N_M1UDQSN_1) ; port VGA.VGA_G3  [project net G3]
VGA_G4: U100.P15(IO_L74P_AWAKE_1) ; port VGA.VGA_G4  [project net G4]
VGA_G5: U100.N15(IO_L50P_M1UDQS_1) ; port VGA.VGA_G5  [project net G5]
VGA_HS: U100.L14(IO_L61P_1) ; port VGA.VGA_HS  [project net HS]
VGA_R0: U100.N18(IO_L48N_M1DQ9_1) ; port VGA.VGA_R0  [project net R0]
VGA_R1: U100.M18(IO_L47N_LDC_M1DQ1_1) ; port VGA.VGA_R1  [project net R1]
VGA_R2: U100.N17(IO_L48P_HDC_M1DQ8_1) ; port VGA.VGA_R2  [project net R2]
VGA_R3: U100.M14(IO_L53P_1) ; port VGA.VGA_R3  [project net R3]
VGA_R4: U100.N14(IO_L53N_VREF_1) ; port VGA.VGA_R4  [project net R4]
VGA_VS: U100.M13(IO_L61N_1) ; port VGA.VGA_VS
WE_N: U100.E3(IO_L50P_M3WE_3) ; port DDR3.DDR3_WE_N
NetC137_2: C137.2 C138.2 L100.2 R112.1 U101.4(VDD)
NetIC500_2: U100.V13(IO_L14N_D12_2) ; port CON2
NetIC501_2: U100.U13(IO_L14P_D11_2) ; port CON1
NetJTAG_4: JTAG.4 R106.1
NetJTAG_6: JTAG.6 R108.1
NetJTAG_8: JTAG.8 R109.1
NetJTAG_10: JTAG.10 R110.1
NetR100_2: R100.2 U100.C2(IO_L83P_3)
NetR101_2: R101.2 U100.P3(IO_L2N_3)
NetR102_2: R102.2 U100.P13(CMPCS_B_2)
NetR103_2: R103.2 U100.D4(IO_L1P_HSWAPEN_0)
NetR107_2: R107.2 U100.R16(SUSPEND)
NetR111_1: R111.1 U101.3(OUT)
NetR112_2: R112.2 U101.1(OE)
NetR601_1: U100.V16(IO_L2N_CMPMOSI_2) ; port 24C02.EEPROM_SDA
NetR602_1: U100.U16(IO_L2P_CMPCLK_2) ; port 24C02.EEPROM_SCL

Not connected (* = marked no-connect by the designer): JTAG 12*; U100 A12(IO_L41N_0)* C4(IO_L1N_VREF_0)* C12(IO_L47N_0)* C17(IO_L29P_A23_M1A13_1)* C18(IO_L29N_A22_M1A14_1)* D12(IO_L47P_0)* E6(IO_L7N_0)* E7(IO_L9P_0)* E8(IO_L9N_0)* E11(IO_L42N_0)* E13(IO_L63N_SCP6_0)* F7(IO_L7P_0)* F8(IO_L32N_0)* F10(IO_L40N_0)* F11(IO_L42P_0)* F14(IO_L30P_A21_M1RESET_1)* F15(IO_L1P_A25_1)* F16(IO_L1N_A24_VREF_1)* G8(IO_L32P_0)* G11(IO_L40P_0)* H17(IO_L43P_GCLK5_M1DQ4_1)* H18(IO_L43N_GCLK4_M1DQ5_1)* K18(IO_L45N_A0_M1LDQSN_1)* L6(IO_L31P_3)* L17(IO_L46P_FCS_B_M1DQ2_1)* M8(IO_L40P_2)* M16(IO_L47P_FWE_B_M1DQ0_1)* N4(IO_L1P_3)* P4(IO_L2P_3)* P12(IO_L13N_D10_2)* T8(IO_L31N_GCLK30_D15_2)* T9(IO_L32P_GCLK29_2)* V2(PROGRAM_B_2)* V17(DONE_2)*

### Layout directives
rule Matched Net Lengths [Tolerance = 100mil]; net class JTAG: FPGA_TCK, FPGA_TDI, FPGA_TDO, FPGA_TMS

### Notes on the sheet
- XC6SLX16_45 FPGA PART
- (near U100) ADC使用的是并行接口，普通IO即可
- ADC使用的是并行接口，普通IO即可
- (near U100) 使用的是SPI*1速度较低，用普通IO
- DDR3的数据线必须连接到FPGA的引脚名带有DQ的pin；
  DDR3的DQS线必须连接到FPGA的引脚名带有DQS的pin；
  DDR3的地址线连接到FPGA的普通I/O引脚；
  DDR3的DM信号连接到FPGA的引脚名带有DM的pin；
  DDR3的时钟信号要接到FPGA钟的CLK以及CLKN差分时钟信号输出脚
- 使用的是SPI*4
- (near R102) IIC使用普通IO
- USB的时钟需要接到CLK脚 数据线要接到普通IO
- JTAG
- RCC
- 1713304422
- 廖哲霖
- Title
- Size:
- Date:
- File:
- A1
- Number:
- Time:
- Revision:
- Sheet
- of
- (in symbol XC6SLX16_45, part A) Spartan 6; Bank 0; (Part 1 of 8)
- (in symbol XC6SLX16_45, part B) Spartan 6; Bank 1; (Part 2 of 8)
- (in symbol XC6SLX16_45, part C) Spartan 6; Bank 2; (Part 3 of 8)
- (in symbol XC6SLX16_45, part D) Spartan 6; Bank 3; (Part 4 of 8)
- (in symbol XC6SLX16_45, part E) Spartan 6; (Part 5 of 8)
- (in symbol XC6SLX16_45, part F) Spartan 6; (Part 6 of 8)
- (in symbol XC6SLX16_45, part G) Spartan 6; (Part 7 of 8)
- (in symbol XC6SLX16_45, part H) Spartan 6; Config; (Part 8 of 8)

### Library data of the parts
C100-C138 = C: 无极性贴片电容; 版权归属: 源创客; BOM名称: 无极性贴片电容; 学习资源: www.ooocke.com
JTAG = Header  6X2: 6*2P接插件; 版权归属: 源创客; BOM名称: 6*2P接插件; 学习资源: www.ooocke.com
M1-M4 = M3: 铜柱孔; 版权归属: 源创客; BOM名称: 铜柱孔; 学习资源: www.ooocke.com
R100-R112 = R: 贴片电阻; 版权归属: 源创客; BOM名称: 贴片电阻; 学习资源: www.ooocke.com
S100 = S1: 版权归属: 源创客; BOM名称: 散热片; 学习资源: www.ooocke.com

## Sheet Power.SchDoc
size A2; Organization: Altium Limited; Address1: L3, 12a Rodborough Rd; Address2: Frenchs Forest; Address3: NSW; Address4: Australia 2086
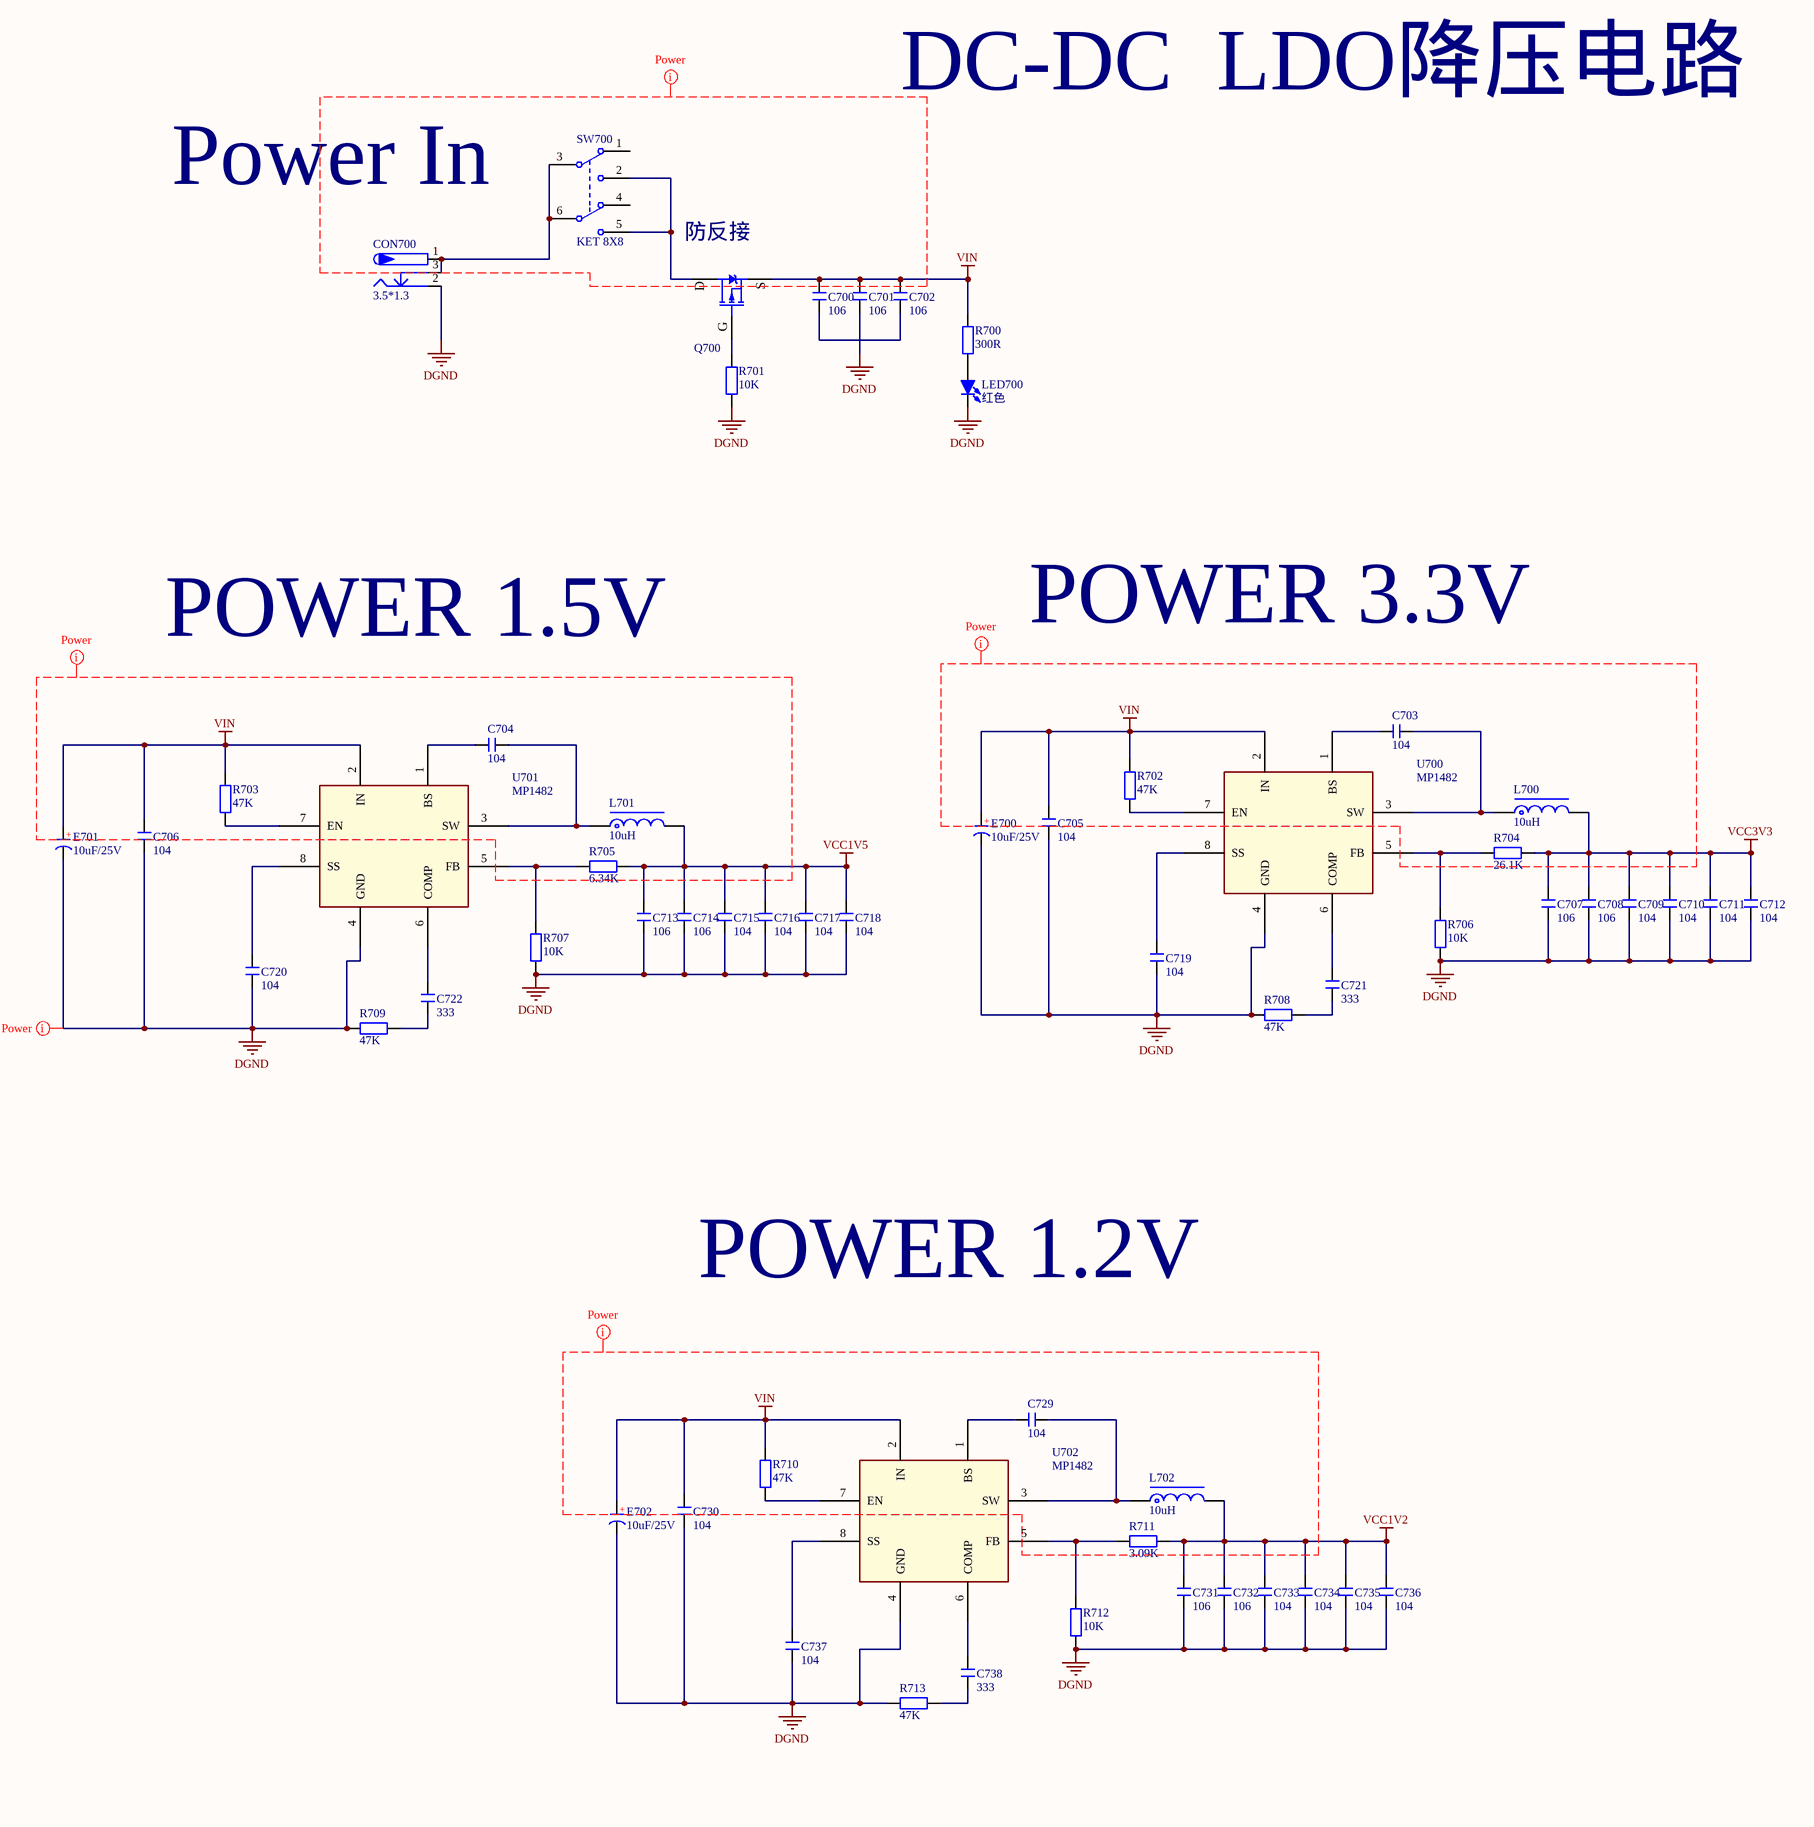
[diagram p6: Power.SchDoc, left]
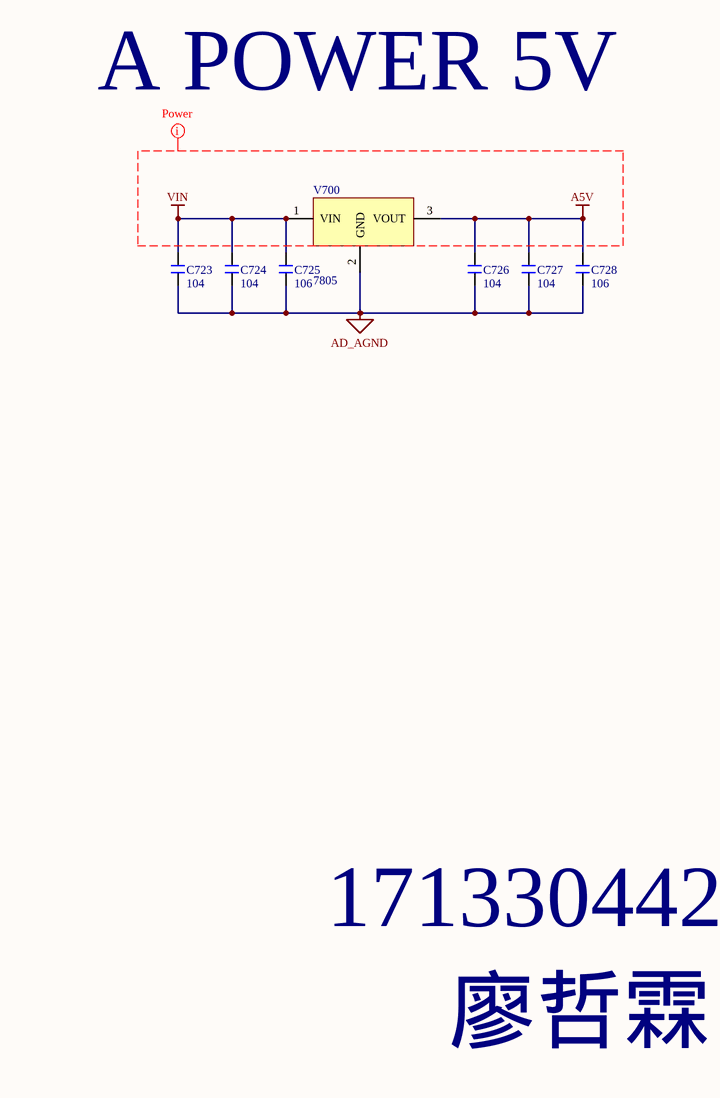
[diagram p7: Power.SchDoc, right]

### Parts
C700  106  [C 0402_M]
C701  106  [C 0402_M]
C702  106  [C 0402_M]
C703  104  [C 0402_M]
C704  104  [C 0402_M]
C705  104  [C 0402_M]
C706  104  [C 0402_M]
C707  106  [C 0402_M]
C708  106  [C 0402_M]
C709  104  [C 0402_M]
C710  104  [C 0402_M]
C711  104  [C 0402_M]
C712  104  [C 0402_M]
C713  106  [C 0402_M]
C714  106  [C 0402_M]
C715  104  [C 0402_M]
C716  104  [C 0402_M]
C717  104  [C 0402_M]
C718  104  [C 0402_M]
C719  104  [C 0402_M]
C720  104  [C 0402_M]
C721  333  [C 0402_M]
C722  333  [C 0402_M]
C723  104  [C 0402_M]
C724  104  [C 0402_M]
C725  106  [C 0402_M]
C726  104  [C 0402_M]
C727  104  [C 0402_M]
C728  106  [C 0402_M]
C729  104  [C 0402_M]
C730  104  [C 0402_M]
C731  106  [C 0402_M]
C732  106  [C 0402_M]
C733  104  [C 0402_M]
C734  104  [C 0402_M]
C735  104  [C 0402_M]
C736  104  [C 0402_M]
C737  104  [C 0402_M]
C738  333  [C 0402_M]
CON700  3.5*1.3  [DC-005]
E700  10uF/25V  [CS 2.5*6.3*11 - C]
E701  10uF/25V  [CS 2.5*6.3*11 - C]
E702  10uF/25V  [CS 2.5*6.3*11 - C]
L700  10uH  [CD43]
L701  10uH  [CD43]
L702  10uH  [CD43]
LED700  红色  [LED 0603W]
Q700  D15P05  [TO252]  (value not drawn)
R700  300R  [R 0402_M]
R701  10K  [R 0402_M]
R702  47K  [R 0402_M]
R703  47K  [R 0402_M]
R704  26.1K  [R 0402_M]
R705  6.34K  [R 0402_M]
R706  10K  [R 0402_M]
R707  10K  [R 0402_M]
R708  47K  [R 0402_M]
R709  47K  [R 0402_M]
R710  47K  [R 0402_M]
R711  3.09K  [R 0402_M]
R712  10K  [R 0402_M]
R713  47K  [R 0402_M]
SW700  KET 8X8  [KFT DIP-8X8]
U700  MP1482  [SOP8_M]
U701  MP1482  [SOP8_M]
U702  MP1482  [SOP8_M]
V700  7805  [TO252]

### Nets
A5V: C726.2 C727.2 C728.2 V700.3(VOUT)
AD_AGND: C723.1 C724.1 C725.1 C726.1 C727.1 C728.1 V700.2(GND)
DGND: C701.1 C705.1 C706.1 C707.1 C708.1 C709.1 C710.1 C711.1 C712.1 C713.1 C714.1 C715.1 C716.1 C717.1 C718.1 C719.1 C720.1 C730.1 C731.1 C732.1 C733.1 C734.1 C735.1 C736.1 C737.1 CON700.2 E700.2(K) E701.2(K) E702.2(K) LED700.2(K) R701.2 R706.2 R707.2 R708.2 R709.2 R712.2 R713.2 U700.4(GND) U701.4(GND) U702.4(GND)
VCC1V2: C731.2 C732.2 C733.2 C734.2 C735.2 C736.2 L702.2 R711.1
VCC1V5: C713.2 C714.2 C715.2 C716.2 C717.2 C718.2 L701.2 R705.1
VCC3V3: C707.2 C708.2 C709.2 C710.2 C711.2 C712.2 L700.2 R704.1
VIN: C700.2 C701.2 C702.2 C705.2 C706.2 C723.2 C724.2 C725.2 C730.2 E700.1(A) E701.1(A) E702.1(A) Q700.3(S) R700.1 R702.2 R703.2 R710.2 U700.2(IN) U701.2(IN) U702.2(IN) V700.1(VIN)
NetC700_1: C700.1 C702.1
NetC703_1: C703.1 L700.1 U700.3(SW)
NetC703_2: C703.2 U700.1(BS)
NetC704_1: C704.1 L701.1 U701.3(SW)
NetC704_2: C704.2 U701.1(BS)
NetC719_2: C719.2 U700.8(SS)
NetC720_2: C720.2 U701.8(SS)
NetC721_1: C721.1 R708.1
NetC721_2: C721.2 U700.6(COMP)
NetC722_1: C722.1 R709.1
NetC722_2: C722.2 U701.6(COMP)
NetC729_1: C729.1 L702.1 U702.3(SW)
NetC729_2: C729.2 U702.1(BS)
NetC737_2: C737.2 U702.8(SS)
NetC738_1: C738.1 R713.1
NetC738_2: C738.2 U702.6(COMP)
NetCON700_1: CON700.1 CON700.3 SW700.3(NO1) SW700.6(NC2)
NetLED700_1: LED700.1(A) R700.2
NetQ700_1: Q700.1(G) R701.1
NetQ700_2: Q700.2(D) SW700.2(COM2) SW700.5(COM2)
NetR702_1: R702.1 U700.7(EN)
NetR703_1: R703.1 U701.7(EN)
NetR704_2: R704.2 R706.1 U700.5(FB)
NetR705_2: R705.2 R707.1 U701.5(FB)
NetR710_1: R710.1 U702.7(EN)
NetR711_2: R711.2 R712.1 U702.5(FB)

Not connected (* = marked no-connect by the designer): SW700 1(NC1) 4(NO2)

### Layout directives
net class Power: (no net found under the mark), A5V, DGND, VIN

### Notes on the sheet
- DC-DC  LDO降压电路
- Power In
- (near Q700) 防反接
- POWER 1.5V
- POWER 3.3V
- A POWER 5V
- POWER 1.2V
- 1713304422
- 廖哲霖
- Title
- Size:
- Date:
- File:
- A2
- Number:
- Time:
- Revision:
- Sheet
- of
- (in symbol C-CS) +

### Library data of the parts
C700-C738 = C: 无极性贴片电容; 版权归属: 源创客; BOM名称: 无极性贴片电容; 学习资源: www.ooocke.com
CON700 = P-DC: 低压电源接口; BOM名称: DC电源接口; 版权归属: 源创客; 学习资源: www.ooocke.com
E700-E702 = C-CS: 直插固态电容; 版权归属: 源创客; BOM名称: 直插固态电容; 学习资源: www.ooocke.com
L700-L702 = L-CD: 贴片功率电感; BOM名称: 功率电感; 版权归属: 源创客; 学习资源: www.ooocke.com
LED700 = LED-SMD: 贴片LED; 版权归属: 源创客; BOM名称: 贴片LED; 学习资源: www.ooocke.com
Q700 = D15P05: P沟道场效应管; 版权归属: 源创客; BOM名称: P沟道场效应管; 学习资源: www.ooocke.com
R700-R713 = R: 贴片电阻; 版权归属: 源创客; BOM名称: 贴片电阻; 学习资源: www.ooocke.com
SW700 = KET 8X8: 8*8自锁开关; 版权归属: 源创客; BOM名称: 8*8自锁开关; 学习资源: www.ooocke.com
V700 = 78xx: 线性稳压芯片; 版权归属: 源创客; BOM名称: 线性稳压芯片; 学习资源: www.ooocke.com

## Sheet 1G Eternet.SchDoc
size A3; Organization: Altium Limited; Address1: L3, 12a Rodborough Rd; Address2: Frenchs Forest; Address3: NSW; Address4: Australia 2086
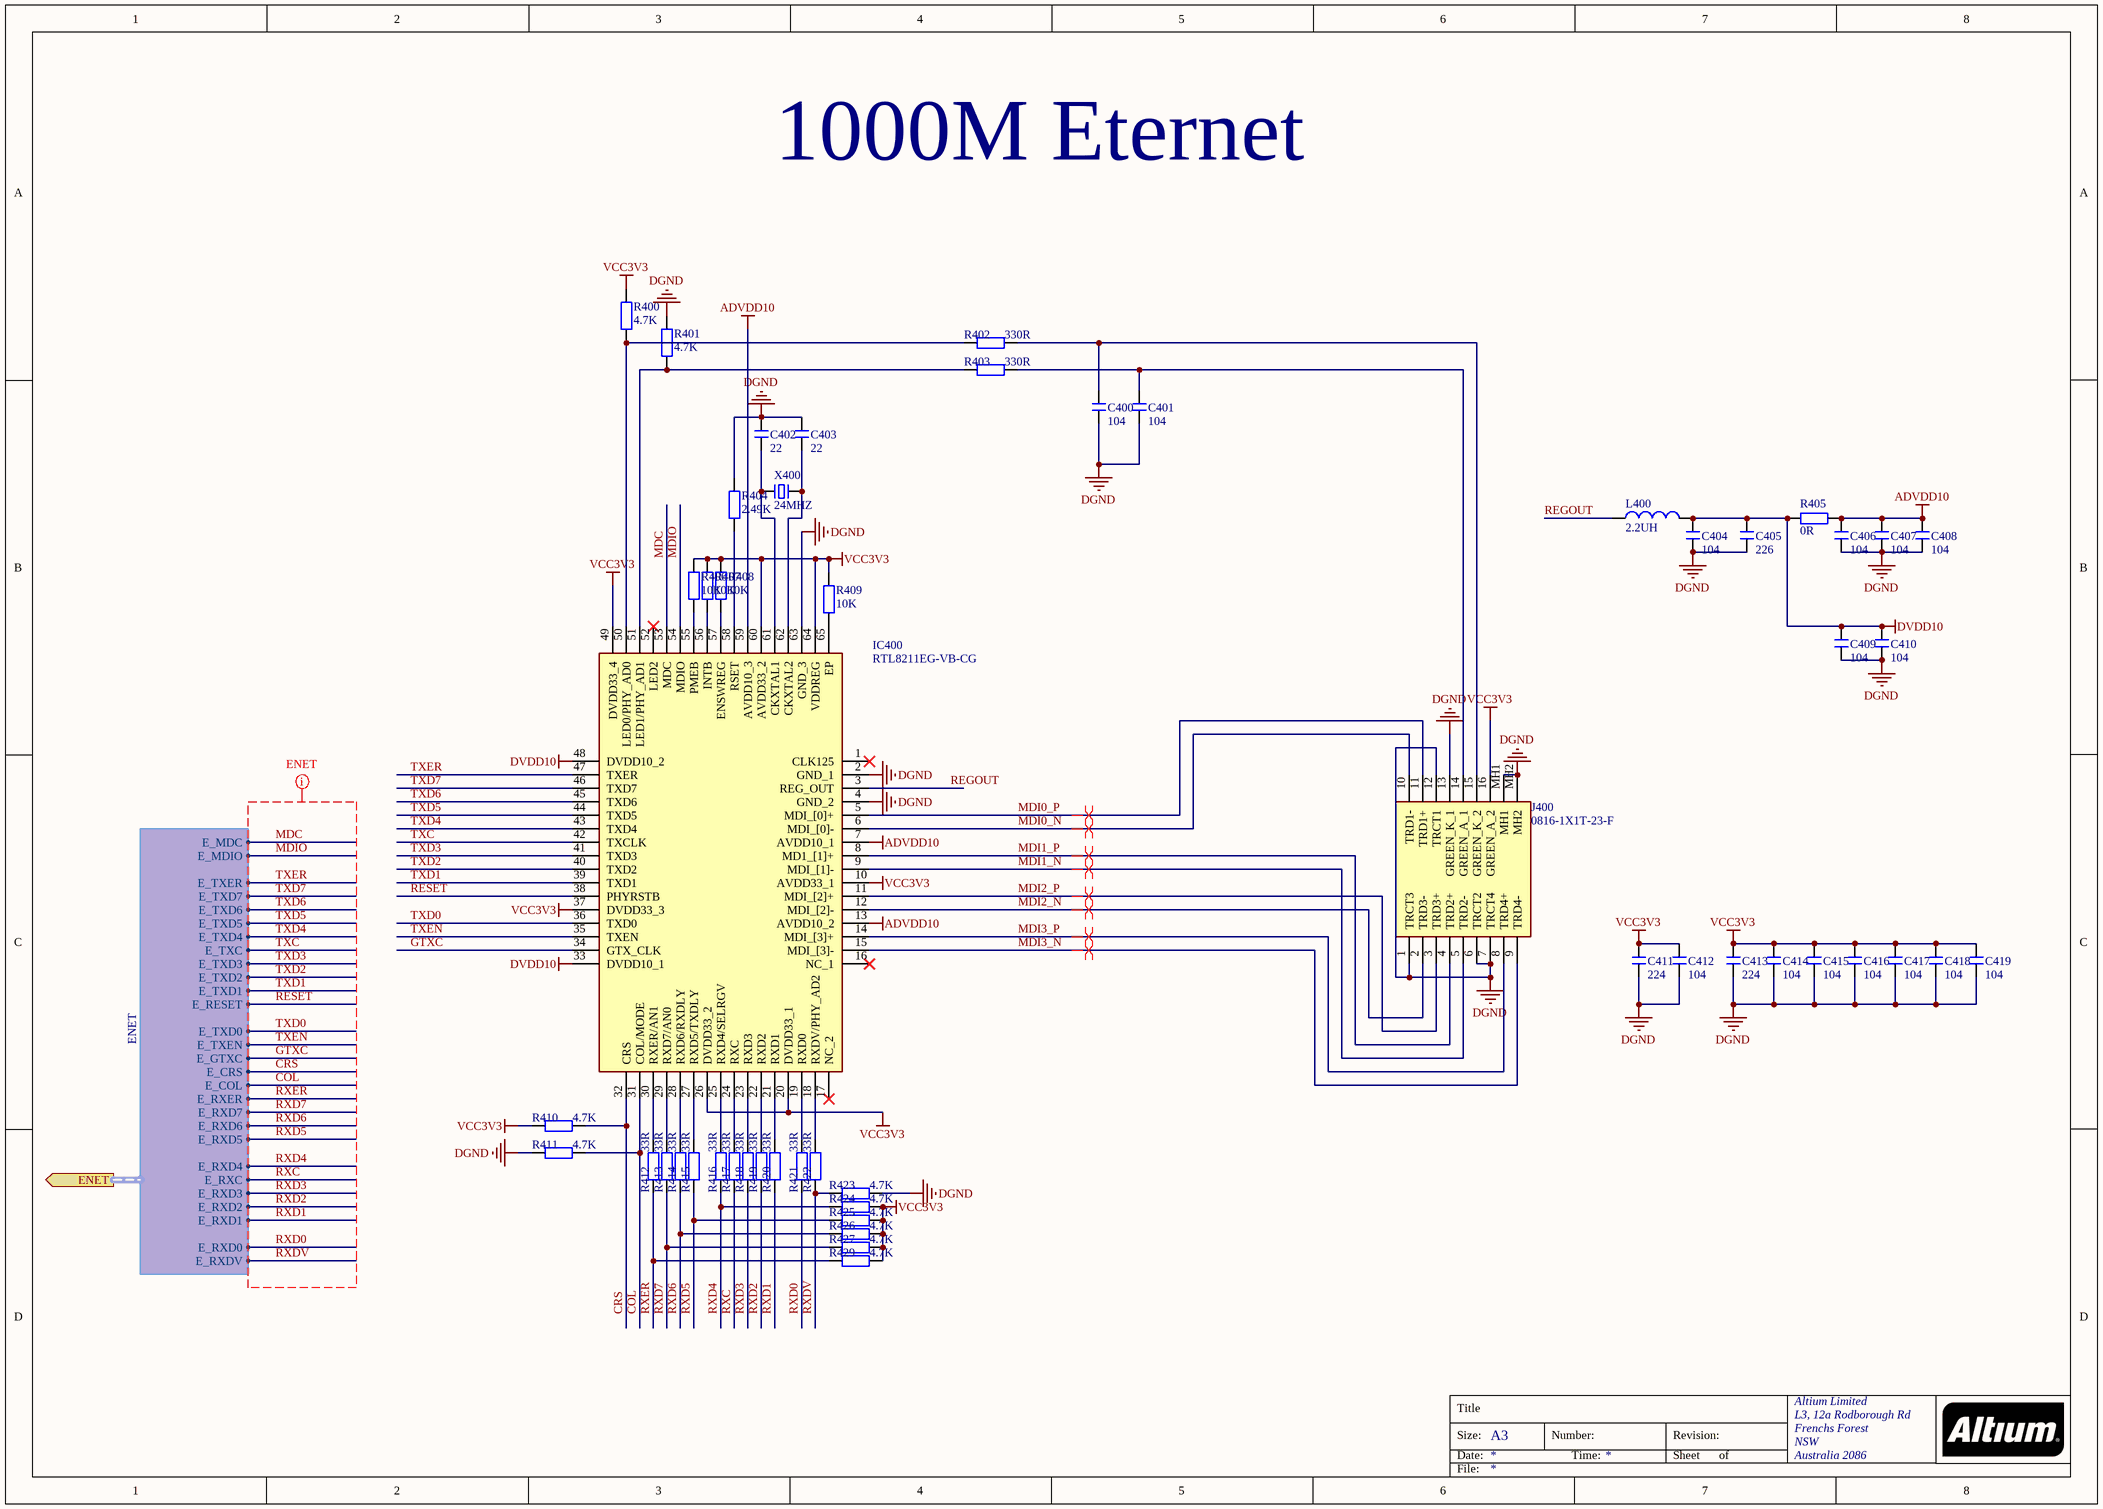
[diagram p8: 1G Eternet.SchDoc]

### Parts
C400  104  [C 0402_M]
C401  104  [C 0402_M]
C402  22  [C 0402_M]
C403  22  [C 0402_M]
C404  104  [C 0402_M]
C405  226  [C 0402_M]
C406  104  [C 0402_M]
C407  104  [C 0402_M]
C408  104  [C 0402_M]
C409  104  [C 0402_M]
C410  104  [C 0402_M]
C411  224  [C 0402_M]
C412  104  [C 0402_M]
C413  224  [C 0402_M]
C414  104  [C 0402_M]
C415  104  [C 0402_M]
C416  104  [C 0402_M]
C417  104  [C 0402_M]
C418  104  [C 0402_M]
C419  104  [C 0402_M]
IC400  RTL8211EG-VB-CG  [QFN50P900X900X100-65N-D]
J400  0816-1X1T-23-F  [08161X1T23F]
L400  2.2UH  [L 0805]
R400  4.7K  [R 0402_M]
R401  4.7K  [R 0402_M]
R402  330R  [R 0402_M]
R403  330R  [R 0402_M]
R404  2.49K  [R 0402_M]
R405  0R  [R 0402_M]
R406  10K  [R 0402_M]
R407  10K  [R 0402_M]
R408  10K  [R 0402_M]
R409  10K  [R 0402_M]
R410  4.7K  [R 0402_M]
R411  4.7K  [R 0402_M]
R412  33R  [R 0402_M]
R413  33R  [R 0402_M]
R414  33R  [R 0402_M]
R415  33R  [R 0402_M]
R416  33R  [R 0402_M]
R417  33R  [R 0402_M]
R418  33R  [R 0402_M]
R419  33R  [R 0402_M]
R420  33R  [R 0402_M]
R421  33R  [R 0402_M]
R422  33R  [R 0402_M]
R423  4.7K  [R 0402_M]
R424  4.7K  [R 0402_M]
R425  4.7K  [R 0402_M]
R426  4.7K  [R 0402_M]
R427  4.7K  [R 0402_M]
R429  4.7K  [R 0402_M]
X400  24MHZ  [OSC 5032-2P]

### Ports
ENET (out, harness ENET)

### Harnesses
ENET: E_RXD7, E_RXD6, E_RXD5, E_RXD4, E_RXD3, E_RXD2, E_RXD1, E_RXD0, E_CRS, E_COL, E_RXDV, E_RXER, E_RXC, E_TXER, E_TXC, E_TXD3, E_TXD2, E_TXD7, E_TXD6, E_TXD5, E_TXD4, E_TXD1, E_RESET, E_TXD0, E_TXEN, E_GTXC, E_MDC, E_MDIO

### Nets
ADVDD10: C406.2 C407.2 C408.2 IC400.7(AVDD10_1) IC400.13(AVDD10_2) IC400.59(AVDD10_3) R405.2
DGND: C400.1 C401.1 C402.2 C403.2 C404.1 C405.1 C406.1 C407.1 C408.1 C409.1 C410.1 C411.1 C412.1 C413.1 C414.1 C415.1 C416.1 C417.1 C418.1 C419.1 IC400.2(GND_1) IC400.4(GND_2) IC400.63(GND_3) J400.1(TRCT3) J400.6(TRCT2) J400.7(TRCT4) J400.12(TRCT1) J400.13(GREEN_K_1) J400.MH1 J400.MH2 R401.1 R404.1 R411.2 R423.2
DVDD10: C404.2 C405.2 C409.2 C410.2 IC400.33(DVDD10_1) IC400.48(DVDD10_2) L400.2 R405.1
VCC3V3: C411.2 C412.2 C413.2 C414.2 C415.2 C416.2 C417.2 C418.2 C419.2 IC400.10(AVDD33_1) IC400.20(DVDD33_1) IC400.26(DVDD33_2) IC400.37(DVDD33_3) IC400.49(DVDD33_4) IC400.60(AVDD33_2) IC400.64(VDDREG) J400.16(GREEN_A_2) R400.1 R406.1 R407.1 R408.1 R409.1 R410.2 R424.2 R425.2 R426.2 R427.2 R429.2
COL: IC400.31(COL/MODE) R411.1 ; port ENET.E_COL
CRS: IC400.32(CRS) R410.1 ; port ENET.E_CRS
GTXC: IC400.34(GTX_CLK) ; port ENET.E_GTXC
MDC: IC400.53(MDC) ; port ENET.E_MDC
MDI0_N: IC400.6(MDI_[0]-) J400.10(TRD1-)
MDI0_P: IC400.5(MDI_[0]+) J400.11(TRD1+)
MDI1_N: IC400.9(MDI_[1]-) J400.5(TRD2-)
MDI1_P: IC400.8(MD1_[1]+) J400.4(TRD2+)
MDI2_N: IC400.12(MDI_[2]-) J400.2(TRD3-)
MDI2_P: IC400.11(MDI_[2]+) J400.3(TRD3+)
MDI3_N: IC400.15(MDI_[3]-) J400.9(TRD4-)
MDI3_P: IC400.14(MDI_[3]+) J400.8(TRD4+)
MDIO: IC400.54(MDIO) ; port ENET.E_MDIO
REGOUT: IC400.3(REG_OUT) L400.1
RESET: IC400.38(PHYRSTB) ; port ENET.E_RESET
RXC: R417.2 ; port ENET.E_RXC
RXD0: R421.2 ; port ENET.E_RXD0
RXD1: R420.2 ; port ENET.E_RXD1
RXD2: R419.2 ; port ENET.E_RXD2
RXD3: R418.2 ; port ENET.E_RXD3
RXD4: R416.2 R424.1 ; port ENET.E_RXD4
RXD5: R415.2 R425.1 ; port ENET.E_RXD5
RXD6: R414.2 R426.1 ; port ENET.E_RXD6
RXD7: R413.2 R427.1 ; port ENET.E_RXD7
RXDV: R422.2 R423.1 ; port ENET.E_RXDV
RXER: R412.2 R429.1 ; port ENET.E_RXER
TXC: IC400.42(TXCLK) ; port ENET.E_TXC
TXD0: IC400.36(TXD0) ; port ENET.E_TXD0
TXD1: IC400.39(TXD1) ; port ENET.E_TXD1
TXD2: IC400.40(TXD2) ; port ENET.E_TXD2
TXD3: IC400.41(TXD3) ; port ENET.E_TXD3
TXD4: IC400.43(TXD4) ; port ENET.E_TXD4
TXD5: IC400.44(TXD5) ; port ENET.E_TXD5
TXD6: IC400.45(TXD6) ; port ENET.E_TXD6
TXD7: IC400.46(TXD7) ; port ENET.E_TXD7
TXEN: IC400.35(TXEN) ; port ENET.E_TXEN
TXER: IC400.47(TXER) ; port ENET.E_TXER
NetC400_2: C400.2 J400.15(GREEN_K_2) R402.1
NetC401_2: C401.2 J400.14(GREEN_A_1) R403.1
NetC402_1: C402.1 IC400.61(CKXTAL1) X400.2
NetC403_1: C403.1 IC400.62(CKXTAL2) X400.1
NetIC400_18: IC400.18(RXDV/PHY_AD2) R422.1
NetIC400_19: IC400.19(RXD0) R421.1
NetIC400_21: IC400.21(RXD1) R420.1
NetIC400_22: IC400.22(RXD2) R419.1
NetIC400_23: IC400.23(RXD3) R418.1
NetIC400_24: IC400.24(RXC) R417.1
NetIC400_25: IC400.25(RXD4/SELRGV) R416.1
NetIC400_27: IC400.27(RXD5/TXDLY) R415.1
NetIC400_28: IC400.28(RXD6/RXDLY) R414.1
NetIC400_29: IC400.29(RXD7/AN0) R413.1
NetIC400_30: IC400.30(RXER/AN1) R412.1
NetIC400_50: IC400.50(LED0/PHY_AD0) R400.2 R402.2
NetIC400_51: IC400.51(LED1/PHY_AD1) R401.2 R403.2
NetIC400_55: IC400.55(PMEB) R406.2
NetIC400_56: IC400.56(INTB) R407.2
NetIC400_57: IC400.57(ENSWREG) R408.2
NetIC400_58: IC400.58(RSET) R404.2
NetIC400_65: IC400.65(EP) R409.2

Not connected (* = marked no-connect by the designer): IC400 1(CLK125)* 16(NC_1)* 17(NC_2)* 52(LED2)*

### Layout directives
differential pair; differential pair class Eternet; rule Matched Net Lengths [Tolerance = 5mil]: MDI0_N, MDI0_P, MDI1_N, MDI1_P, MDI2_N, MDI2_P, MDI3_N, MDI3_P
net class ENET; rule Matched Net Lengths [Tolerance = 100mil]: COL, CRS, GTXC, MDC, MDIO, RESET, RXC, RXD0, RXD1, RXD2, RXD3, RXD4, RXD5, RXD6, RXD7, RXDV, RXER, TXC, TXD0, TXD1, TXD2, TXD3, TXD4, TXD5, TXD6, TXD7, TXEN, TXER

### Notes on the sheet
- 1000M Eternet
- Title
- Size:
- Date:
- A3
- Number:
- Time:
- Revision:
- Sheet
- of
- File:

### Library data of the parts
C400-C419 = C: 无极性贴片电容; 版权归属: 源创客; BOM名称: 无极性贴片电容; 学习资源: www.ooocke.com
IC400 = RTL8211EG-VB-CG: Integrated Circuit; Manufacturer_Name: Realtek; Datasheet Link: http://download3.dvd-driver.cz/realtek/datasheets/pdf/rtl8211e(g)-vb(vl)-cg_datasheet_1.6.pdf; Height: 1mm; Manufacturer_Part_Number: RTL8211EG-VB-CG
J400 = 0816-1X1T-23-F: Connector; Manufacturer_Name: Bel Magnetic Solutions; Datasheet Link: https://componentsearchengine.com/Datasheets/1/0816-1X1T-23-F.pdf; Height: 11.43mm; Manufacturer_Part_Number: 0816-1X1T-23-F; Mouser Part Number: 530-0816-1X1T-23-F; Mouser Price/Stock: https://www.mouser.com/Search/Refine.aspx?Keyword=530-0816-1X1T-23-F
L400 = INDUCTOR
R400-R427 R429 = R: 贴片电阻; 版权归属: 源创客; BOM名称: 贴片电阻; 学习资源: www.ooocke.com
X400 = XTAL-2P: 2脚无源脚晶振; 版权归属: 源创客; BOM名称: 2脚无源脚晶振; 学习资源: www.ooocke.com

## Sheet USB2.0.SchDoc
size A3; Organization: Altium Limited; Address1: L3, 12a Rodborough Rd; Address2: Frenchs Forest; Address3: NSW; Address4: Australia 2086
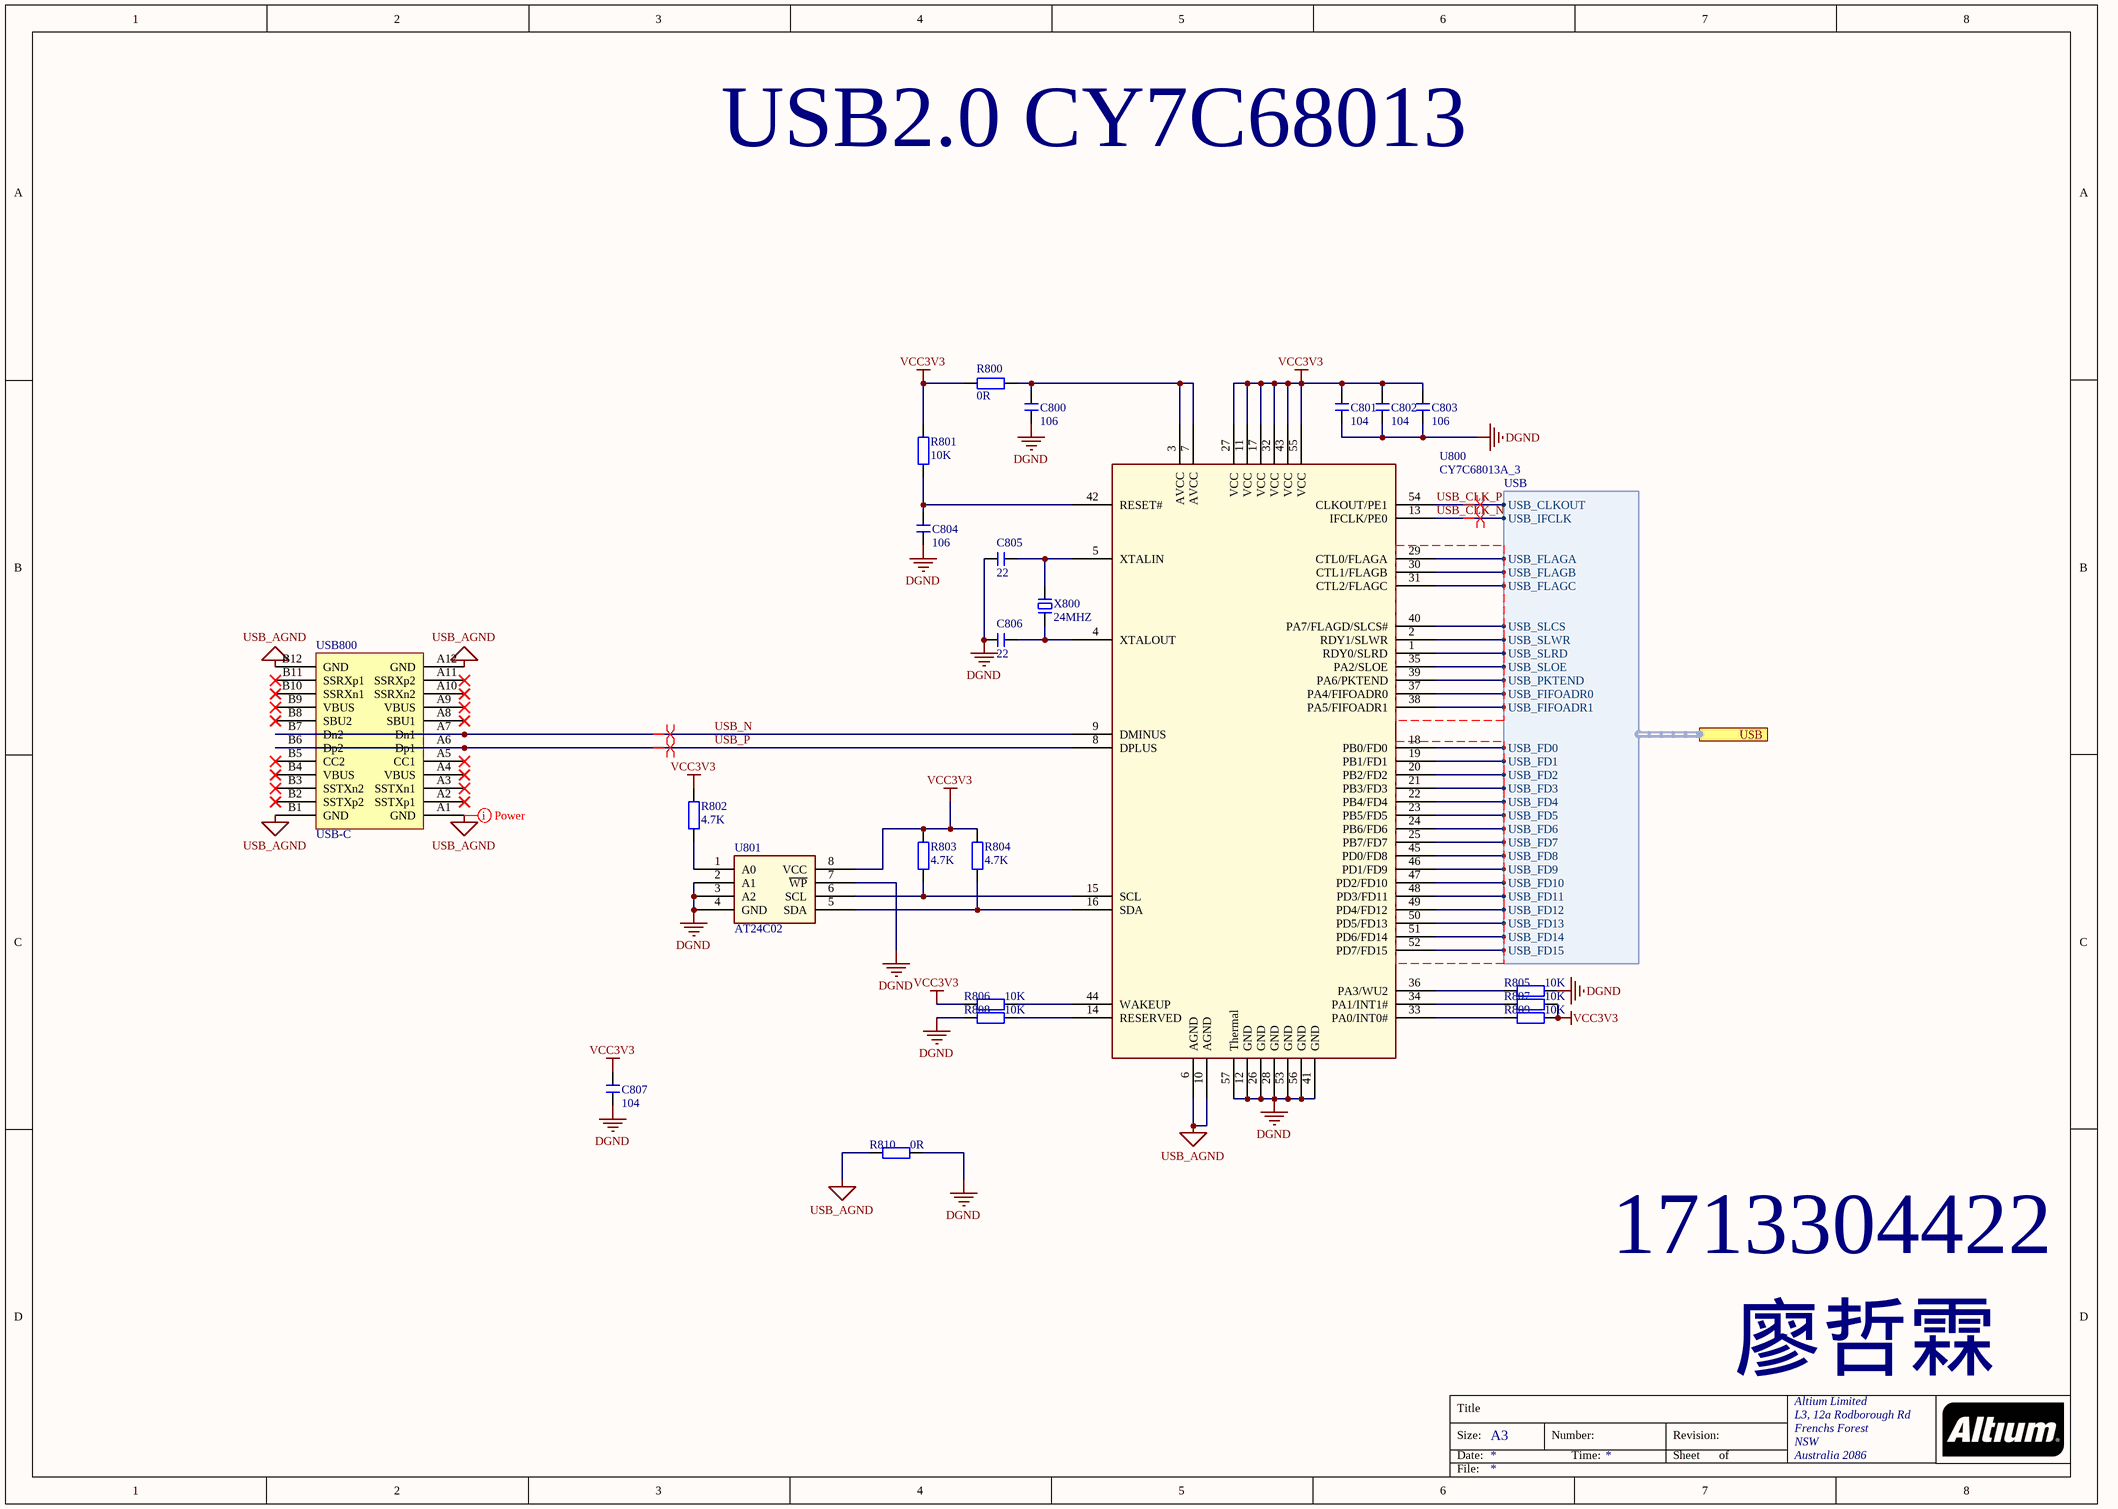
[diagram p9: USB2.0.SchDoc]

### Parts
C800  106  [C 0402_M]
C801  104  [C 0402_M]
C802  104  [C 0402_M]
C803  106  [C 0402_M]
C804  106  [C 0402_M]
C805  22  [C 0402_M]
C806  22  [C 0402_M]
C807  104  [C 0402_M]
R800  0R  [R 0402_M]
R801  10K  [R 0402_M]
R802  4.7K  [R 0402_M]
R803  4.7K  [R 0402_M]
R804  4.7K  [R 0402_M]
R805  10K  [R 0402_M]
R806  10K  [R 0402_M]
R807  10K  [R 0402_M]
R808  10K  [R 0402_M]
R809  10K  [R 0402_M]
R810  0R  [R 0402_M]
U800  CY7C68013A_3  [QFN50P800X800X100-57N]
U801  AT24C02  [SOP8_M]
USB800  USB-C  [USB-C/S_A]
X800  24MHZ  [OSC 5032-2P]

### Ports
USB (harness USB)

### Harnesses
USB: USB_CLKOUT, USB_IFCLK, USB_FLAGA, USB_FLAGB, USB_FLAGC, USB_SLCS, USB_SLWR, USB_SLRD, USB_SLOE, USB_PKTEND, USB_FIFOADR1, USB_FD0, USB_FD1, USB_FD2, USB_FD3, USB_FD4, USB_FD5, USB_FD6, USB_FD7, USB_FD8, USB_FD9, USB_FD10, USB_FD11, USB_FD12, USB_FD13, USB_FD14, USB_FD15, USB_FIFOADR0

### Nets
DGND: C800.1 C801.1 C802.1 C803.1 C804.1 C805.2 C806.2 C807.2 R805.2 R808.1 R810.2 U800.12(GND) U800.26(GND) U800.28(GND) U800.41(GND) U800.53(GND) U800.56(GND) U800.57(Thermal) U801.2(A1) U801.3(A2) U801.4(GND) U801.7(~{WP})
USB_AGND: R810.1 U800.6(AGND) U800.10(AGND) USB800.A1(GND) USB800.A12(GND) USB800.B1(GND) USB800.B12(GND)
VCC3V3: C801.2 C802.2 C803.2 C807.1 R800.2 R801.1 R802.1 R803.1 R804.1 R806.1 R807.2 R809.2 U800.11(VCC) U800.17(VCC) U800.27(VCC) U800.32(VCC) U800.43(VCC) U800.55(VCC) U801.8(VCC)
USB_CLK_N: U800.13(IFCLK/PE0) ; port USB.USB_IFCLK
USB_CLK_P: U800.54(CLKOUT/PE1) ; port USB.USB_CLKOUT
USB_FD0: U800.18(PB0/FD0) ; port USB.USB_FD0
USB_FD1: U800.19(PB1/FD1) ; port USB.USB_FD1
USB_FD2: U800.20(PB2/FD2) ; port USB.USB_FD2
USB_FD3: U800.21(PB3/FD3) ; port USB.USB_FD3
USB_FD4: U800.22(PB4/FD4) ; port USB.USB_FD4
USB_FD5: U800.23(PB5/FD5) ; port USB.USB_FD5
USB_FD6: U800.24(PB6/FD6) ; port USB.USB_FD6
USB_FD7: U800.25(PB7/FD7) ; port USB.USB_FD7
USB_FD8: U800.45(PD0/FD8) ; port USB.USB_FD8
USB_FD9: U800.46(PD1/FD9) ; port USB.USB_FD9
USB_FD10: U800.47(PD2/FD10) ; port USB.USB_FD10
USB_FD11: U800.48(PD3/FD11) ; port USB.USB_FD11
USB_FD12: U800.49(PD4/FD12) ; port USB.USB_FD12
USB_FD13: U800.50(PD5/FD13) ; port USB.USB_FD13
USB_FD14: U800.51(PD6/FD14) ; port USB.USB_FD14
USB_FD15: U800.52(PD7/FD15) ; port USB.USB_FD15
USB_FIFOADR0: U800.37(PA4/FIFOADR0) ; port USB.USB_FIFOADR0
USB_FIFOADR1: U800.38(PA5/FIFOADR1) ; port USB.USB_FIFOADR1
USB_FLAGA: U800.29(CTL0/FLAGA) ; port USB.USB_FLAGA
USB_FLAGB: U800.30(CTL1/FLAGB) ; port USB.USB_FLAGB
USB_FLAGC: U800.31(CTL2/FLAGC) ; port USB.USB_FLAGC
USB_N: U800.9(DMINUS) USB800.A7(Dn1) USB800.B7(Dn2)
USB_P: U800.8(DPLUS) USB800.A6(Dp1) USB800.B6(Dp2)
USB_PKTEND: U800.39(PA6/PKTEND) ; port USB.USB_PKTEND
USB_SLCS: U800.40(PA7/FLAGD/SLCS#) ; port USB.USB_SLCS
USB_SLOE: U800.35(PA2/SLOE) ; port USB.USB_SLOE
USB_SLRD: U800.1(RDY0/SLRD) ; port USB.USB_SLRD
USB_SLWR: U800.2(RDY1/SLWR) ; port USB.USB_SLWR
NetC800_2: C800.2 R800.1 U800.3(AVCC) U800.7(AVCC)
NetC804_2: C804.2 R801.2 U800.42(RESET#)
NetC805_1: C805.1 U800.5(XTALIN) X800.2
NetC806_1: C806.1 U800.4(XTALOUT) X800.1
NetR802_2: R802.2 U801.1(A0)
NetR803_2: R803.2 U800.15(SCL) U801.6(SCL)
NetR804_2: R804.2 U800.16(SDA) U801.5(SDA)
NetR805_1: R805.1 U800.36(PA3/WU2)
NetR806_2: R806.2 U800.44(WAKEUP)
NetR807_1: R807.1 U800.34(PA1/INT1#)
NetR808_2: R808.2 U800.14(RESERVED)
NetR809_1: R809.1 U800.33(PA0/INT0#)

Not connected (* = marked no-connect by the designer): USB800 A2(SSTXp1)* A3(SSTXn1)* A4(VBUS)* A5(CC1)* A8(SBU1)* A9(VBUS)* A10(SSRXn2)* A11(SSRXp2)* B2(SSTXp2)* B3(SSTXn2)* B4(VBUS)* B5(CC2)* B8(SBU2)* B9(VBUS)* B10(SSRXn1)* B11(SSRXp1)*

### Layout directives
net class Power: USB_AGND
differential pair; differential pair class USB; rule Matched Net Lengths [Tolerance = 5mil]: USB_CLK_N, USB_CLK_P, USB_N, USB_P
net class USB_FD; rule Matched Net Lengths [Tolerance = 100mil]: (no net found under the mark)
net class USB_FIFO; rule Matched Net Lengths [Tolerance = 100mil]: (no net found under the mark)

### Notes on the sheet
- USB2.0 CY7C68013
- 1713304422
- 廖哲霖
- Title
- Size:
- Date:
- A3
- Number:
- Time:
- Revision:
- Sheet
- of
- File:

### Library data of the parts
C800-C807 = C: 无极性贴片电容; 版权归属: 源创客; BOM名称: 无极性贴片电容; 学习资源: www.ooocke.com
R800-R810 = R: 贴片电阻; 版权归属: 源创客; BOM名称: 贴片电阻; 学习资源: www.ooocke.com
USB800 = USB-C/S: USB-C型母接口; 版权归属: 源创客; BOM名称: USB-C型母接口; 学习资源: www.ooocke.com
X800 = XTAL-2P: 2脚无源脚晶振; 版权归属: 源创客; BOM名称: 2脚无源脚晶振; 学习资源: www.ooocke.com

## Sheet DDR3 RAM.SchDoc
size A3; Organization: Altium Limited; Address1: L3, 12a Rodborough Rd; Address2: Frenchs Forest; Address3: NSW; Address4: Australia 2086
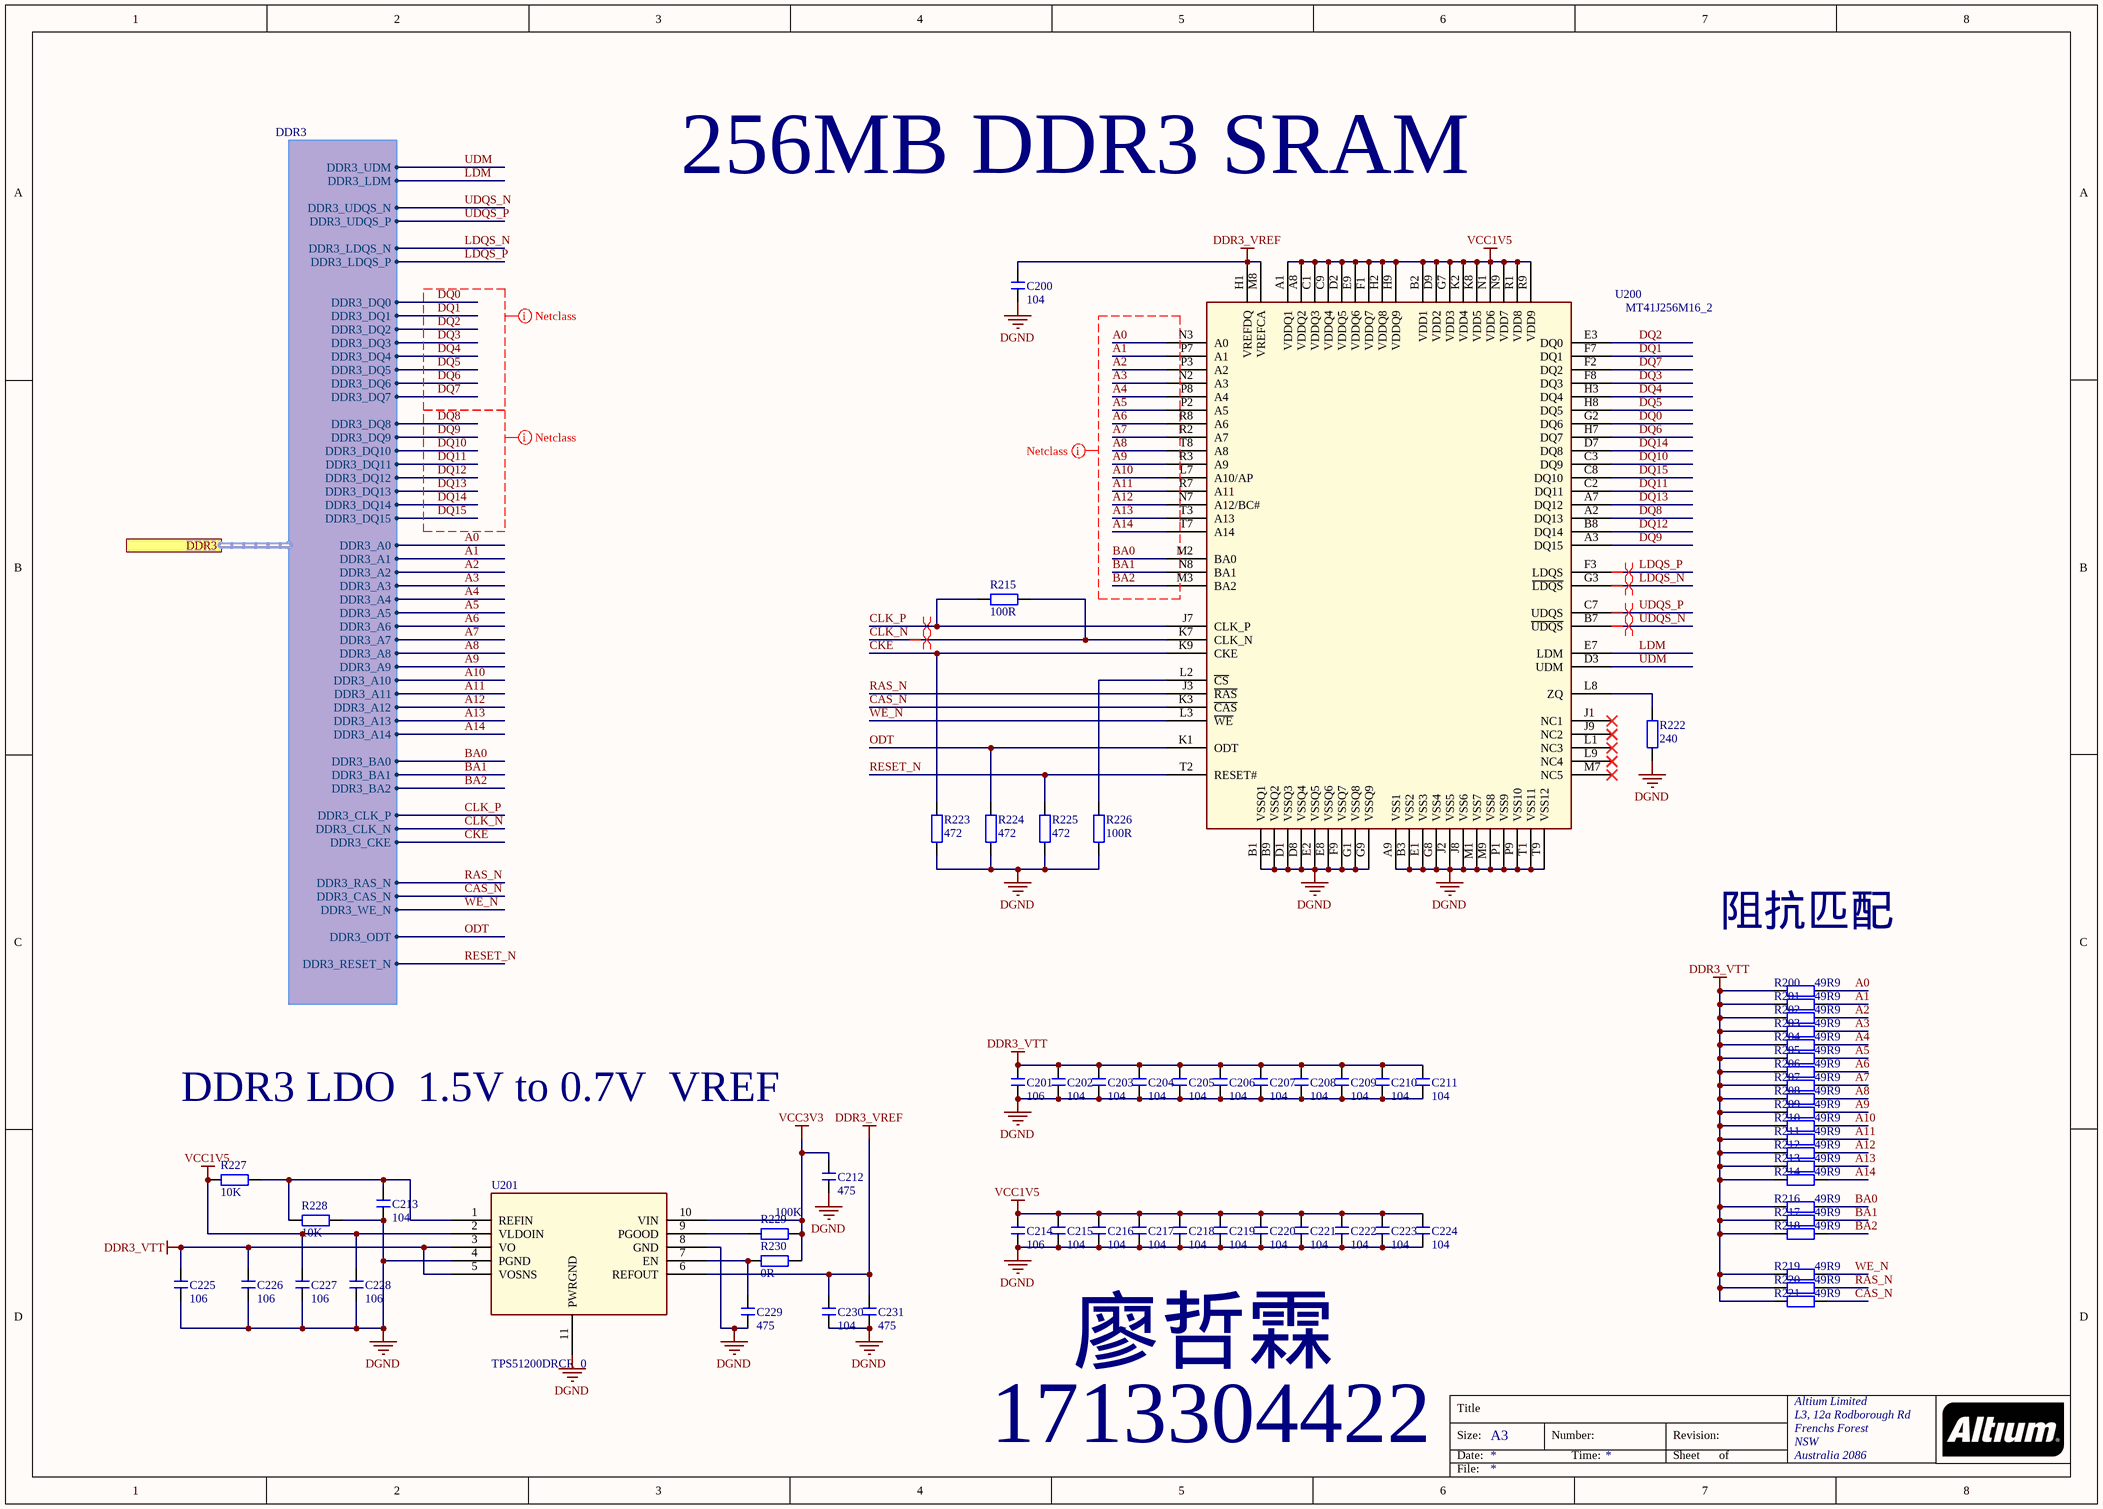
[diagram p10: DDR3 RAM.SchDoc]

### Parts
C200  104  [C 0402_M]
C201  106  [C 0402_M]
C202  104  [C 0402_M]
C203  104  [C 0402_M]
C204  104  [C 0402_M]
C205  104  [C 0402_M]
C206  104  [C 0402_M]
C207  104  [C 0402_M]
C208  104  [C 0402_M]
C209  104  [C 0402_M]
C210  104  [C 0402_M]
C211  104  [C 0402_M]
C212  475  [C 0402_M]
C213  104  [C 0402_M]
C214  106  [C 0402_M]
C215  104  [C 0402_M]
C216  104  [C 0402_M]
C217  104  [C 0402_M]
C218  104  [C 0402_M]
C219  104  [C 0402_M]
C220  104  [C 0402_M]
C221  104  [C 0402_M]
C222  104  [C 0402_M]
C223  104  [C 0402_M]
C224  104  [C 0402_M]
C225  106  [C 0402_M]
C226  106  [C 0402_M]
C227  106  [C 0402_M]
C228  106  [C 0402_M]
C229  475  [C 0402_M]
C230  104  [C 0402_M]
C231  475  [C 0402_M]
R200  49R9  [R 0402_M]
R201  49R9  [R 0402_M]
R202  49R9  [R 0402_M]
R203  49R9  [R 0402_M]
R204  49R9  [R 0402_M]
R205  49R9  [R 0402_M]
R206  49R9  [R 0402_M]
R207  49R9  [R 0402_M]
R208  49R9  [R 0402_M]
R209  49R9  [R 0402_M]
R210  49R9  [R 0402_M]
R211  49R9  [R 0402_M]
R212  49R9  [R 0402_M]
R213  49R9  [R 0402_M]
R214  49R9  [R 0402_M]
R215  100R  [R 0402_M]
R216  49R9  [R 0402_M]
R217  49R9  [R 0402_M]
R218  49R9  [R 0402_M]
R219  49R9  [R 0402_M]
R220  49R9  [R 0402_M]
R221  49R9  [R 0402_M]
R222  240  [R 0402_M]
R223  472  [R 0402_M]
R224  472  [R 0402_M]
R225  472  [R 0402_M]
R226  100R  [R 0402_M]
R227  10K  [R 0402_M]
R228  10K  [R 0402_M]
R229  100K  [R 0402_M]
R230  0R  [R 0402_M]
U200  MT41J256M16_2  [BGA96C80P9X16_750X1350X120]
U201  TPS51200DRCR_0  [SON50P300X300X100-11N-D]

### Ports
DDR3 (harness DDR3)

### Harnesses
DDR3: DDR3_CLK_P, DDR3_CLK_N, DDR3_CKE, DDR3_RAS_N, DDR3_CAS_N, DDR3_WE_N, DDR3_ODT, DDR3_RESET_N, DDR3_A0, DDR3_A1, DDR3_A2, DDR3_A3, DDR3_A4, DDR3_A5, DDR3_A6, DDR3_A7, DDR3_A8, DDR3_A9, DDR3_A10, DDR3_A11, DDR3_A12, DDR3_A13, DDR3_A14, DDR3_BA0, DDR3_BA1, DDR3_BA2, DDR3_LDQS_P, DDR3_LDQS_N, DDR3_LDM, DDR3_UDM, DDR3_UDQS_N, DDR3_UDQS_P, DDR3_DQ0, DDR3_DQ1, DDR3_DQ2, DDR3_DQ3, DDR3_DQ4, DDR3_DQ5, DDR3_DQ6, DDR3_DQ7, DDR3_DQ8, DDR3_DQ9, DDR3_DQ10, DDR3_DQ11, DDR3_DQ12, DDR3_DQ13, DDR3_DQ14, DDR3_DQ15

### Nets
DDR3_VREF: C200.2 C230.2 C231.2 U200.H1(VREFDQ) U200.M8(VREFCA) U201.6(REFOUT)
DDR3_VTT: C201.2 C202.2 C203.2 C204.2 C205.2 C206.2 C207.2 C208.2 C209.2 C210.2 C211.2 C225.2 C226.2 R200.1 R201.1 R202.1 R203.1 R204.1 R205.1 R206.1 R207.1 R208.1 R209.1 R210.1 R211.1 R212.1 R213.1 R214.1 R216.1 R217.1 R218.1 R219.1 R220.1 R221.1 U201.3(VO) U201.5(VOSNS)
DGND: C200.1 C201.1 C202.1 C203.1 C204.1 C205.1 C206.1 C207.1 C208.1 C209.1 C210.1 C211.1 C212.1 C213.1 C214.1 C215.1 C216.1 C217.1 C218.1 C219.1 C220.1 C221.1 C222.1 C223.1 C224.1 C225.1 C226.1 C227.1 C228.1 C229.1 C230.1 C231.1 R222.1 R223.1 R224.1 R225.1 R226.1 R228.2 U200.A9(VSS1) U200.B1(VSSQ1) U200.B3(VSS2) U200.B9(VSSQ2) U200.D1(VSSQ3) U200.D8(VSSQ4) U200.E1(VSS3) U200.E2(VSSQ5) U200.E8(VSSQ6) U200.F9(VSSQ7) U200.G1(VSSQ8) U200.G8(VSS4) U200.G9(VSSQ9) U200.J2(VSS5) U200.J8(VSS6) U200.M1(VSS7) U200.M9(VSS8) U200.P1(VSS9) U200.P9(VSS10) U200.T1(VSS11) U200.T9(VSS12) U201.4(PGND) U201.8(GND) U201.11(PWRGND)
VCC1V5: C214.2 C215.2 C216.2 C217.2 C218.2 C219.2 C220.2 C221.2 C222.2 C223.2 C224.2 C227.2 C228.2 R227.1 U200.A1(VDDQ1) U200.A8(VDDQ2) U200.B2(VDD1) U200.C1(VDDQ3) U200.C9(VDDQ4) U200.D2(VDDQ5) U200.D9(VDD2) U200.E9(VDDQ6) U200.F1(VDDQ7) U200.G7(VDD3) U200.H2(VDDQ8) U200.H9(VDDQ9) U200.K2(VDD4) U200.K8(VDD5) U200.N1(VDD6) U200.N9(VDD7) U200.R1(VDD8) U200.R9(VDD9) U201.2(VLDOIN)
VCC3V3: C212.2 R229.2 R230.2 U201.10(VIN)
A0: R200.2 U200.N3(A0) ; port DDR3.DDR3_A0
A1: R201.2 U200.P7(A1) ; port DDR3.DDR3_A1
A2: R202.2 U200.P3(A2) ; port DDR3.DDR3_A2
A3: R203.2 U200.N2(A3) ; port DDR3.DDR3_A3
A4: R204.2 U200.P8(A4) ; port DDR3.DDR3_A4
A5: R205.2 U200.P2(A5) ; port DDR3.DDR3_A5
A6: R206.2 U200.R8(A6) ; port DDR3.DDR3_A6
A7: R207.2 U200.R2(A7) ; port DDR3.DDR3_A7
A8: R208.2 U200.T8(A8) ; port DDR3.DDR3_A8
A9: R209.2 U200.R3(A9) ; port DDR3.DDR3_A9
A10: R210.2 U200.L7(A10/AP) ; port DDR3.DDR3_A10
A11: R211.2 U200.R7(A11) ; port DDR3.DDR3_A11
A12: R212.2 U200.N7(A12/BC#) ; port DDR3.DDR3_A12
A13: R213.2 U200.T3(A13) ; port DDR3.DDR3_A13
A14: R214.2 U200.T7(A14) ; port DDR3.DDR3_A14
BA0: R216.2 U200.M2(BA0) ; port DDR3.DDR3_BA0
BA1: R217.2 U200.N8(BA1) ; port DDR3.DDR3_BA1
BA2: R218.2 U200.M3(BA2) ; port DDR3.DDR3_BA2
CAS_N: R221.2 U200.K3(~{CAS}) ; port DDR3.DDR3_CAS_N
CKE: R223.2 U200.K9(CKE) ; port DDR3.DDR3_CKE
CLK_N: R215.1 U200.K7(CLK_N) ; port DDR3.DDR3_CLK_N
CLK_P: R215.2 U200.J7(CLK_P) ; port DDR3.DDR3_CLK_P
DQ0: U200.G2(DQ6) ; port DDR3.DDR3_DQ0
DQ1: U200.F7(DQ1) ; port DDR3.DDR3_DQ1
DQ2: U200.E3(DQ0) ; port DDR3.DDR3_DQ2
DQ3: U200.F8(DQ3) ; port DDR3.DDR3_DQ3
DQ4: U200.H3(DQ4) ; port DDR3.DDR3_DQ4
DQ5: U200.H8(DQ5) ; port DDR3.DDR3_DQ5
DQ6: U200.H7(DQ7) ; port DDR3.DDR3_DQ6
DQ7: U200.F2(DQ2) ; port DDR3.DDR3_DQ7
DQ8: U200.A2(DQ13) ; port DDR3.DDR3_DQ8
DQ9: U200.A3(DQ15) ; port DDR3.DDR3_DQ9
DQ10: U200.C3(DQ9) ; port DDR3.DDR3_DQ10
DQ11: U200.C2(DQ11) ; port DDR3.DDR3_DQ11
DQ12: U200.B8(DQ14) ; port DDR3.DDR3_DQ12
DQ13: U200.A7(DQ12) ; port DDR3.DDR3_DQ13
DQ14: U200.D7(DQ8) ; port DDR3.DDR3_DQ14
DQ15: U200.C8(DQ10) ; port DDR3.DDR3_DQ15
LDM: U200.E7(LDM) ; port DDR3.DDR3_LDM
LDQS_N: U200.G3(~{LDQS}) ; port DDR3.DDR3_LDQS_N
LDQS_P: U200.F3(LDQS) ; port DDR3.DDR3_LDQS_P
ODT: R224.2 U200.K1(ODT) ; port DDR3.DDR3_ODT
RAS_N: R220.2 U200.J3(~{RAS}) ; port DDR3.DDR3_RAS_N
RESET_N: R225.2 U200.T2(RESET#) ; port DDR3.DDR3_RESET_N
UDM: U200.D3(UDM) ; port DDR3.DDR3_UDM
UDQS_N: U200.B7(~{UDQS}) ; port DDR3.DDR3_UDQS_N
UDQS_P: U200.C7(UDQS) ; port DDR3.DDR3_UDQS_P
WE_N: R219.2 U200.L3(~{WE}) ; port DDR3.DDR3_WE_N
NetC213_2: C213.2 R227.2 R228.1 U201.1(REFIN)
NetC229_2: C229.2 R230.1 U201.7(EN)
NetR222_2: R222.2 U200.L8(ZQ)
NetR226_2: R226.2 U200.L2(~{CS})
NetR229_1: R229.1 U201.9(PGOOD)

Not connected (* = marked no-connect by the designer): U200 J1(NC1)* J9(NC2)* L1(NC3)* L9(NC4)* M7(NC5)*

### Layout directives
differential pair; differential pair class DDR3; rule Matched Net Lengths [Tolerance = 5mil]: CLK_N, CLK_P, LDQS_N, LDQS_P, UDQS_N, UDQS_P
net class ADDR; rule Matched Net Lengths [Tolerance = 50mil]; rule Width Constraint [Pref Width = 6mil    Min Width = 6mil    Max Width = 10mil]: A0, A1, A2, A3, A4, A5, A6, A7, A8, A9, A10, A11, A12, A13, A14, BA0, BA1, BA2
net class DQ0-DQ7; rule Matched Net Lengths [Tolerance = 50mil]; rule Width Constraint [Pref Width = 6mil    Min Width = 6mil    Max Width = 10mil]: DQ0, DQ1, DQ2, DQ3, DQ4, DQ5, DQ6, DQ7
net class DQ7-DQ15; rule Matched Net Lengths [Tolerance = 50mil]; rule Width Constraint [Pref Width = 6mil    Min Width = 6mil    Max Width = 10mil]: DQ8, DQ9, DQ10, DQ11, DQ12, DQ13, DQ14, DQ15

### Notes on the sheet
- 256MB DDR3 SRAM
- 阻抗匹配
- DDR3 LDO  1.5V to 0.7V  VREF
- 廖哲霖
- 1713304422
- Title
- Size:
- Date:
- A3
- Number:
- Time:
- Revision:
- Sheet
- of
- File:

### Library data of the parts
C200-C231 = C: 无极性贴片电容; 版权归属: 源创客; BOM名称: 无极性贴片电容; 学习资源: www.ooocke.com
R200-R230 = R: 贴片电阻; 版权归属: 源创客; BOM名称: 贴片电阻; 学习资源: www.ooocke.com